# EAGLE design CARA_ctrl_v1_2 (EAGLE 7.3.0)

## Sheet 1 of 5

## Sheet 2 of 5
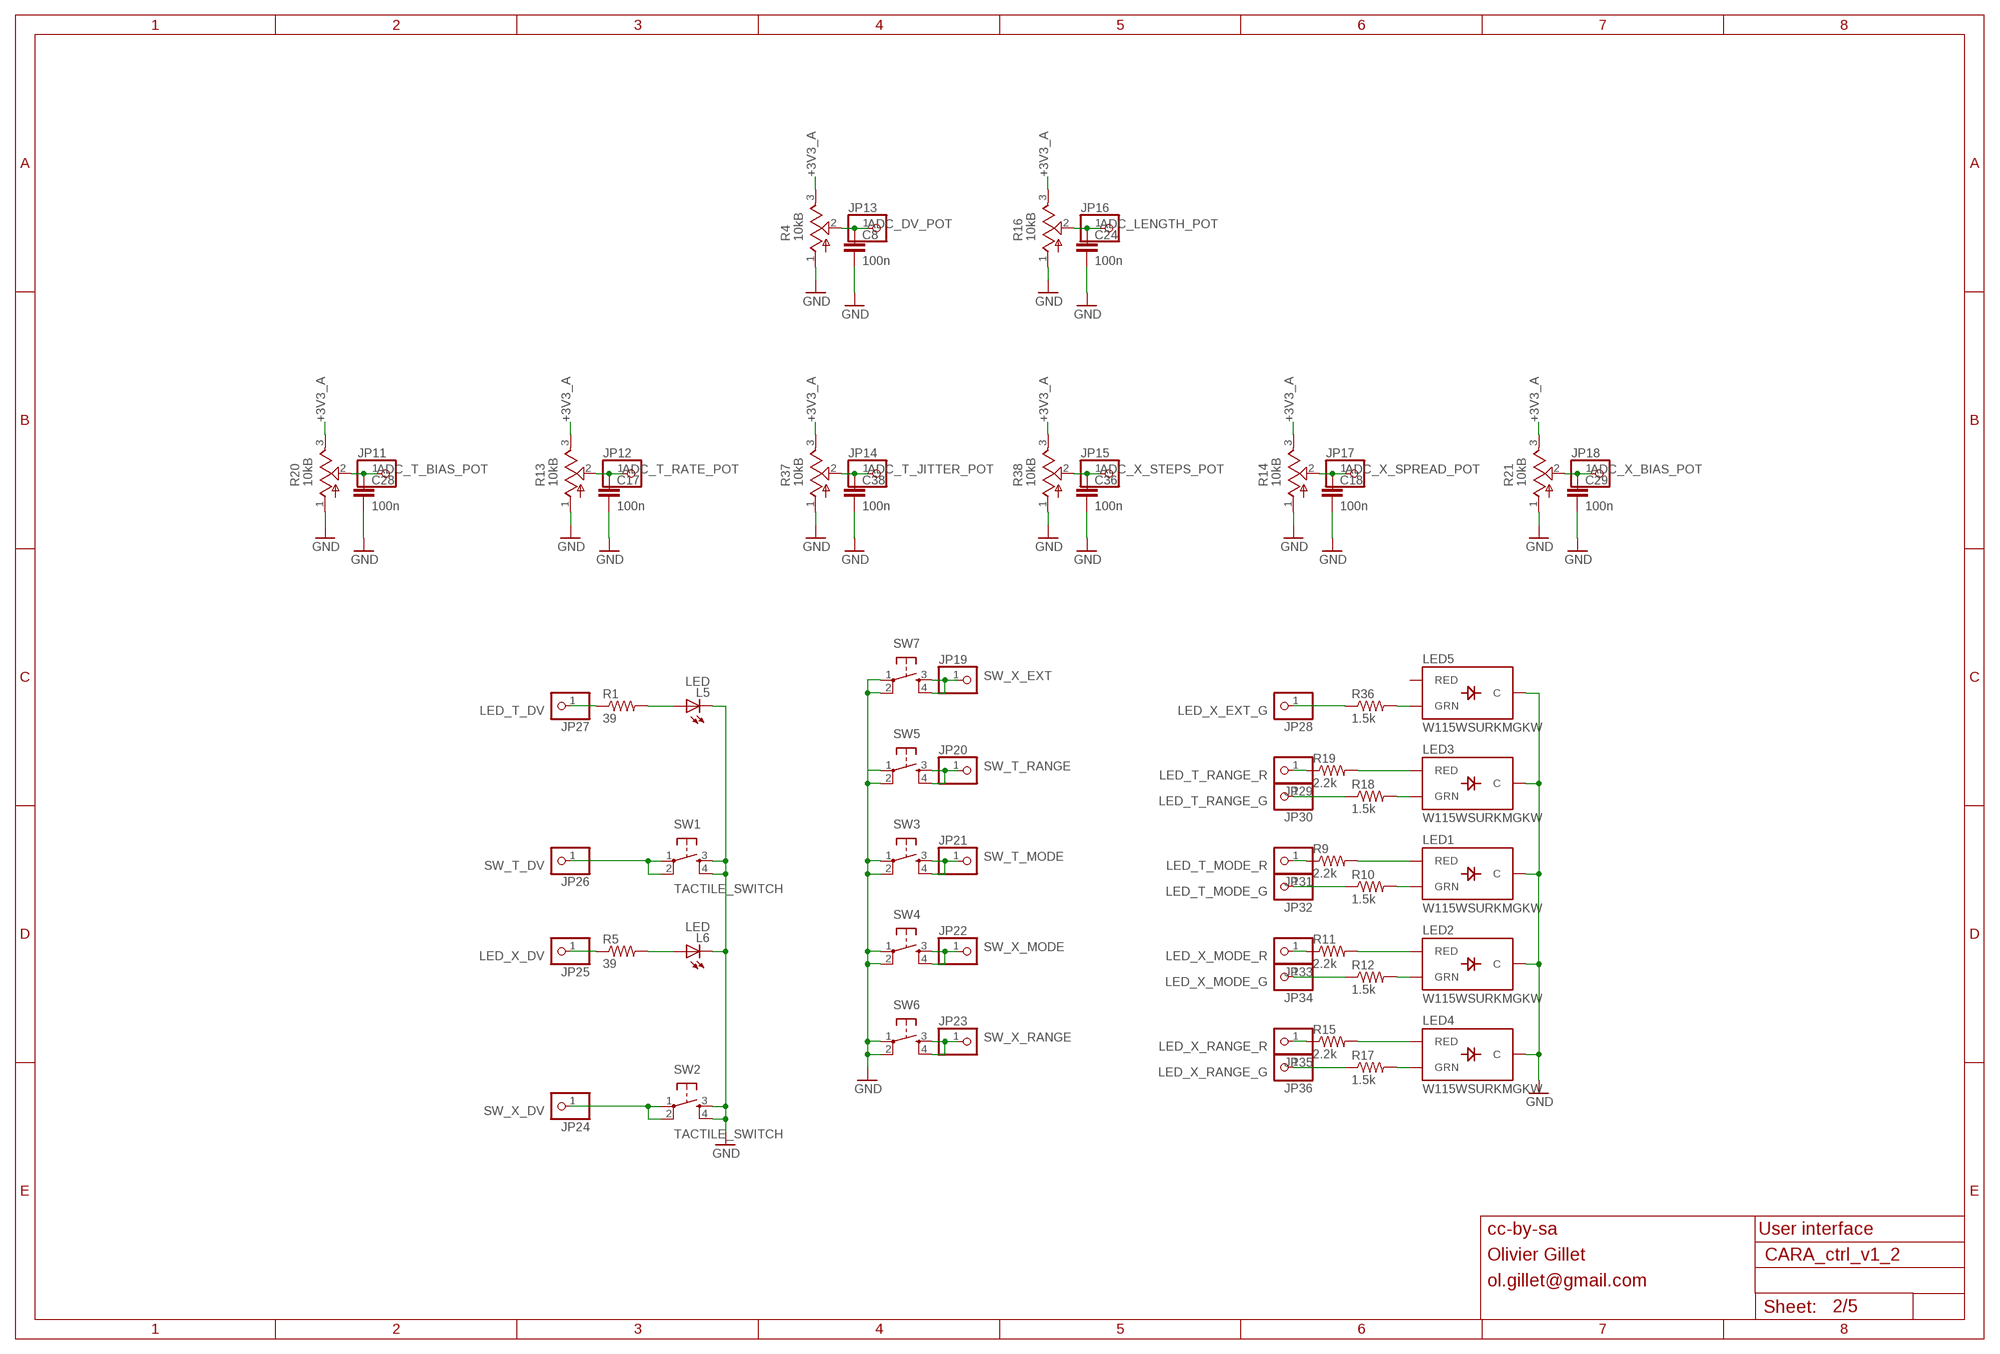
[diagram p0: schematic, sheet 2]

### Parts
C8  100n  CAPACITOR  [RESISTOR_0603]
C17  100n  CAPACITOR  [RESISTOR_0603]
C18  100n  CAPACITOR  [RESISTOR_0603]
C24  100n  CAPACITOR  [RESISTOR_0603]
C28  100n  CAPACITOR  [RESISTOR_0603]
C29  100n  CAPACITOR  [RESISTOR_0603]
C36  100n  CAPACITOR  [RESISTOR_0603]
C38  100n  CAPACITOR  [RESISTOR_0603]
JP11  PINHD-1X1  [1X01]
JP12  PINHD-1X1  [1X01]
JP13  PINHD-1X1  [1X01]
JP14  PINHD-1X1  [1X01]
JP15  PINHD-1X1  [1X01]
JP16  PINHD-1X1  [1X01]
JP17  PINHD-1X1  [1X01]
JP18  PINHD-1X1  [1X01]
JP19  PINHD-1X1  [1X01]
JP20  PINHD-1X1  [1X01]
JP21  PINHD-1X1  [1X01]
JP22  PINHD-1X1  [1X01]
JP23  PINHD-1X1  [1X01]
JP24  PINHD-1X1  [1X01]
JP25  PINHD-1X1  [1X01]
JP26  PINHD-1X1  [1X01]
JP27  PINHD-1X1  [1X01]
JP28  PINHD-1X1  [1X01]
JP29  PINHD-1X1  [1X01]
JP30  PINHD-1X1  [1X01]
JP31  PINHD-1X1  [1X01]
JP32  PINHD-1X1  [1X01]
JP33  PINHD-1X1  [1X01]
JP34  PINHD-1X1  [1X01]
JP35  PINHD-1X1  [1X01]
JP36  PINHD-1X1  [1X01]
L5  LED  [LED_3MM]
L6  LED  [LED_3MM]
LED1  W115WSURKMGKW  LED_BICOLOR_THROUGHHOLE  [LED_BICOLOR]
LED2  W115WSURKMGKW  LED_BICOLOR_THROUGHHOLE  [LED_BICOLOR]
LED3  W115WSURKMGKW  LED_BICOLOR_THROUGHHOLE  [LED_BICOLOR]
LED4  W115WSURKMGKW  LED_BICOLOR_THROUGHHOLE  [LED_BICOLOR]
LED5  W115WSURKMGKW  LED_BICOLOR_THROUGHHOLE  [LED_BICOLOR]
R1  39  RESISTOR  [RESISTOR_0603]
R4  10kB  POT_VERTICAL  [ALPS_POT_VERTICAL]
R5  39  RESISTOR  [RESISTOR_0603]
R9  2.2k  RESISTOR  [RESISTOR_0603]
R10  1.5k  RESISTOR  [RESISTOR_0603]
R11  2.2k  RESISTOR  [RESISTOR_0603]
R12  1.5k  RESISTOR  [RESISTOR_0603]
R13  10kB  POT_VERTICAL  [ALPS_POT_VERTICAL]
R14  10kB  POT_VERTICAL  [ALPS_POT_VERTICAL]
R15  2.2k  RESISTOR  [RESISTOR_0603]
R16  10kB  POT_VERTICAL  [ALPS_POT_VERTICAL]
R17  1.5k  RESISTOR  [RESISTOR_0603]
R18  1.5k  RESISTOR  [RESISTOR_0603]
R19  2.2k  RESISTOR  [RESISTOR_0603]
R20  10kB  POT_VERTICAL  [ALPS_POT_VERTICAL]
R21  10kB  POT_VERTICAL  [ALPS_POT_VERTICAL]
R36  1.5k  RESISTOR  [RESISTOR_0603]
R37  10kB  POT_VERTICAL  [ALPS_POT_VERTICAL]
R38  10kB  POT_VERTICAL  [ALPS_POT_VERTICAL]
SW1  TACTILE_SWITCH  [TACTILE-PTH]
SW2  TACTILE_SWITCH  [TACTILE-PTH]
SW3  TACTILE_SWITCH  [TACTILE-PTH]
SW4  TACTILE_SWITCH  [TACTILE-PTH]
SW5  TACTILE_SWITCH  [TACTILE-PTH]
SW6  TACTILE_SWITCH  [TACTILE-PTH]
SW7  TACTILE_SWITCH  [TACTILE-PTH]

### Nets
+3V3_A [mid]: R4.3(B) R13.3(B) R14.3(B) R16.3(B) R20.3(B) R21.3(B) R37.3(B) R38.3(B) ; also sheet 5
ADC_DV_POT: C8.1 JP13.1 R4.2(W)
ADC_LENGTH_POT: C24.1 JP16.1 R16.2(W)
ADC_T_BIAS_POT: C28.1 JP11.1 R20.2(W)
ADC_T_JITTER_POT: C38.1 JP14.1 R37.2(W)
ADC_T_RATE_POT: C17.1 JP12.1 R13.2(W)
ADC_X_BIAS_POT: C29.1 JP18.1 R21.2(W)
ADC_X_SPREAD_POT: C18.1 JP17.1 R14.2(W)
ADC_X_STEPS_POT: C36.1 JP15.1 R38.2(W)
GND: C8.2 C17.2 C18.2 C24.2 C28.2 C29.2 C36.2 C38.2 L5.K(C) L6.K(C) LED1.2(C) LED2.2(C) LED3.2(C) LED4.2(C) LED5.2(C) R4.1(A) R13.1(A) R14.1(A) R16.1(A) R20.1(A) R21.1(A) R37.1(A) R38.1(A) SW1.3 SW1.4 SW2.3 SW2.4 SW3.1 SW3.2 SW4.1 SW4.2 SW5.1 SW5.2 SW6.1 SW6.2 SW7.1 SW7.2 ; also sheet 3,4,5
LED_T_DV: JP27.1 R1.1
LED_T_MODE_G: JP32.1 R10.1
LED_T_MODE_R: JP31.1 R9.1
LED_T_RANGE_G: JP30.1 R18.1
LED_T_RANGE_R: JP29.1 R19.1
LED_X_DV: JP25.1 R5.1
LED_X_EXT_G: JP28.1 R36.1
LED_X_MODE_G: JP34.1 R12.1
LED_X_MODE_R: JP33.1 R11.1
LED_X_RANGE_G: JP36.1 R17.1
LED_X_RANGE_R: JP35.1 R15.1
N$1: L5.A R1.2
N$2: L6.A R5.2
N$9: LED3.3(RED) R19.2
N$12: LED3.1(GRN) R18.2
N$16: LED1.3(RED) R9.2
N$18: LED2.3(RED) R11.2
N$20: LED2.1(GRN) R12.2
N$21: LED4.3(RED) R15.2
N$22: LED1.1(GRN) R10.2
N$23: LED4.1(GRN) R17.2
N$42: LED5.1(GRN) R36.2
SW_T_DV: JP26.1 SW1.1 SW1.2
SW_T_MODE: JP21.1 SW3.3 SW3.4
SW_T_RANGE: JP20.1 SW5.3 SW5.4
SW_X_DV: JP24.1 SW2.1 SW2.2
SW_X_EXT: JP19.1 SW7.3 SW7.4
SW_X_MODE: JP22.1 SW4.3 SW4.4
SW_X_RANGE: JP23.1 SW6.3 SW6.4
Unconnected: LED5.3(RED)

### Notes on the sheet
- cc-by-sa | User interface
- Olivier Gillet
- ol.gillet@gmail.com

## Sheet 3 of 5
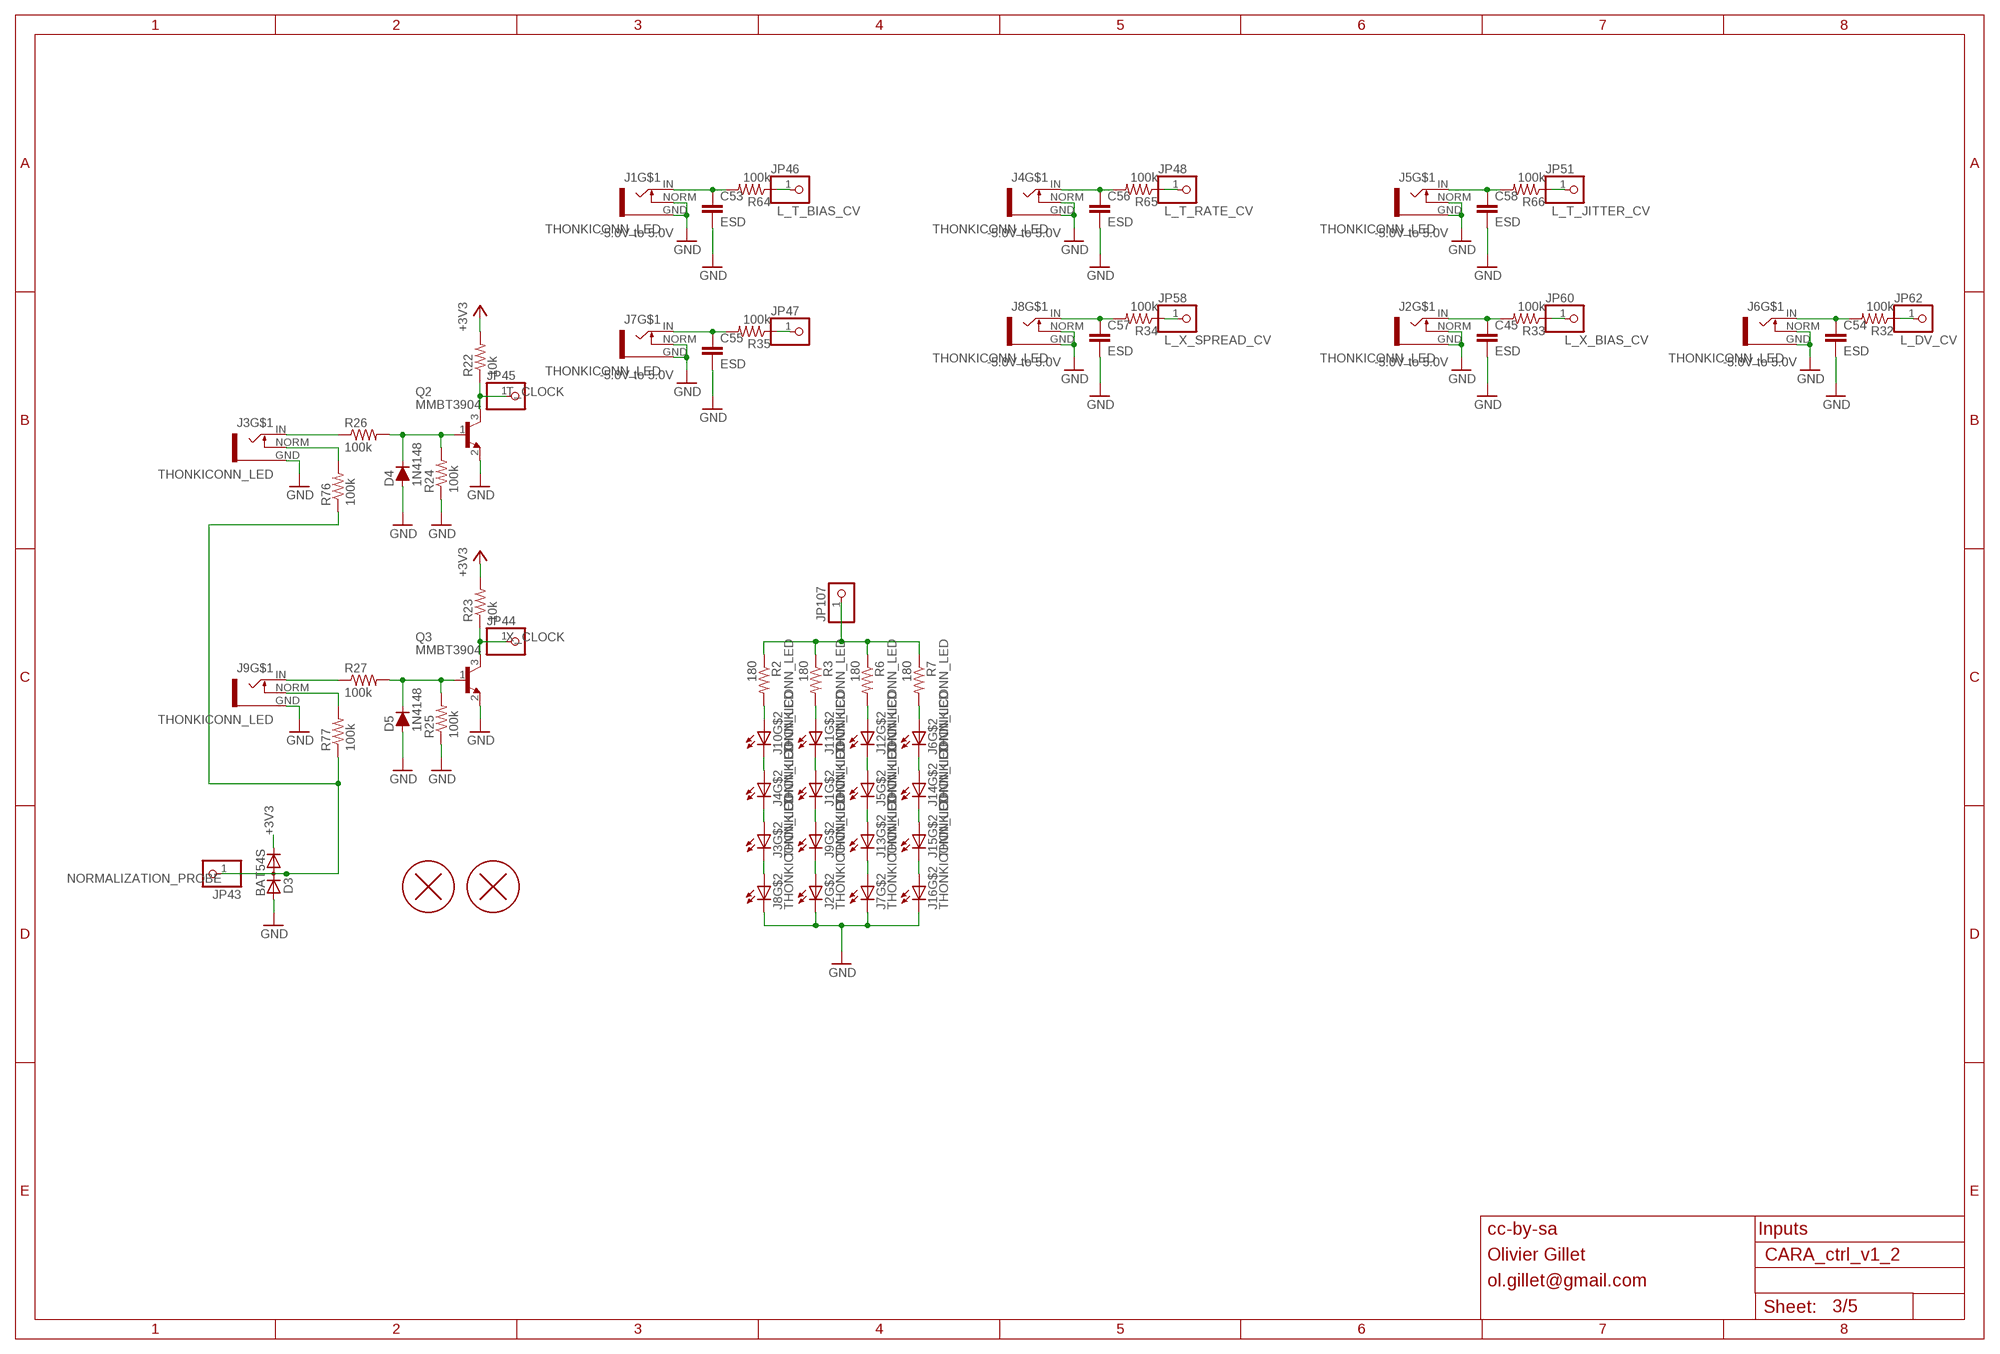
[diagram p1: schematic, sheet 3]

### Parts
C45  ESD  CAPACITOR  [RESISTOR_0603]
C53  ESD  CAPACITOR  [RESISTOR_0603]
C54  ESD  CAPACITOR  [RESISTOR_0603]
C55  ESD  CAPACITOR  [RESISTOR_0603]
C56  ESD  CAPACITOR  [RESISTOR_0603]
C57  ESD  CAPACITOR  [RESISTOR_0603]
C58  ESD  CAPACITOR  [RESISTOR_0603]
D3  BAT54S  DIODE_2CACA-SOT23  [SOT23]
D4  1N4148  DIODE  [SOD123]
D5  1N4148  DIODE  [SOD123]
H1  PCB_SCREW  [PCB_SCREW]
H2  PCB_SCREW  [PCB_SCREW]
J1  THONKICONN_LED  [LED_JACK]
J2  THONKICONN_LED  [LED_JACK]
J3  THONKICONN_LED  [LED_JACK]
J4  THONKICONN_LED  [LED_JACK]
J5  THONKICONN_LED  [LED_JACK]
J6  THONKICONN_LED  [LED_JACK]
J7  THONKICONN_LED  [LED_JACK]
J8  THONKICONN_LED  [LED_JACK]
J9  THONKICONN_LED  [LED_JACK]
J10  THONKICONN_LED  [LED_JACK]
J11  THONKICONN_LED  [LED_JACK]
J12  THONKICONN_LED  [LED_JACK]
J13  THONKICONN_LED  [LED_JACK]
J14  THONKICONN_LED  [LED_JACK]
J15  THONKICONN_LED  [LED_JACK]
J16  THONKICONN_LED  [LED_JACK]
JP43  PINHD-1X1  [1X01]
JP44  PINHD-1X1  [1X01]
JP45  PINHD-1X1  [1X01]
JP46  PINHD-1X1  [1X01]
JP47  PINHD-1X1  [1X01]
JP48  PINHD-1X1  [1X01]
JP51  PINHD-1X1  [1X01]
JP58  PINHD-1X1  [1X01]
JP60  PINHD-1X1  [1X01]
JP62  PINHD-1X1  [1X01]
JP107  PINHD-1X1  [1X01]
Q2  MMBT3904  MMBT3904SOT23  [SOT23]
Q3  MMBT3904  MMBT3904SOT23  [SOT23]
R2  180  RESISTOR  [RESISTOR_0603]
R3  180  RESISTOR  [RESISTOR_0603]
R6  180  RESISTOR  [RESISTOR_0603]
R7  180  RESISTOR  [RESISTOR_0603]
R22  10k  RESISTOR  [RESISTOR_0603]
R23  10k  RESISTOR  [RESISTOR_0603]
R24  100k  RESISTOR  [RESISTOR_0603]
R25  100k  RESISTOR  [RESISTOR_0603]
R26  100k  RESISTOR  [RESISTOR_0603]
R27  100k  RESISTOR  [RESISTOR_0603]
R32  100k  RESISTOR  [RESISTOR_0603]
R33  100k  RESISTOR  [RESISTOR_0603]
R34  100k  RESISTOR  [RESISTOR_0603]
R35  100k  RESISTOR  [RESISTOR_0603]
R64  100k  RESISTOR  [RESISTOR_0603]
R65  100k  RESISTOR  [RESISTOR_0603]
R66  100k  RESISTOR  [RESISTOR_0603]
R76  100k  RESISTOR  [RESISTOR_0603]
R77  100k  RESISTOR  [RESISTOR_0603]

### Nets
+3V3 [mid]: D3.2(C) R22.2 R23.2 ; also sheet 5
GND: C45.2 C53.2 C54.2 C55.2 C56.2 C57.2 C58.2 D3.1(A) D4.+ D5.+ J1.GND J1.NORM J2.C J2.GND J2.NORM J3.GND J4.GND J4.NORM J5.GND J5.NORM J6.GND J6.NORM J7.C J7.GND J7.NORM J8.C J8.GND J8.NORM J9.GND J16.C Q2.2(E) Q3.2(E) R24.1 R25.1 ; also sheet 2,4,5
L_DV_CV: JP62.1 R32.1
L_T_BIAS_CV: JP46.1 R64.1
L_T_JITTER_CV: JP51.1 R66.1
L_T_RATE_CV: JP48.1 R65.1
L_X_BIAS_CV: JP60.1 R33.1
L_X_SPREAD_CV: JP58.1 R34.1
L_X_STEPS_CV: JP47.1 R35.1
MORPH_IN: C53.1 J1.IN R64.2
MORPH_IN1: C55.1 J7.IN R35.2
MORPH_IN3: C56.1 J4.IN R65.2
MORPH_IN4: C57.1 J8.IN R34.2
MORPH_IN5: C54.1 J6.IN R32.2
MORPH_IN6: C58.1 J5.IN R66.2
MORPH_IN7: C45.1 J2.IN R33.2
N$4: J4.A J10.C
N$5: J3.A J4.C
N$6: J1.A J11.C
N$7: J1.C J9.A
N$8: J3.C J8.A
N$10: J5.A J12.C
N$11: J6.C J14.A
N$13: J2.A J9.C
N$15: J5.C J13.A
N$17: J7.A J13.C
N$19: J14.C J15.A
N$25: J15.C J16.A
N$27: J10.A R2.2
N$31: J12.A R6.2
N$32: J6.A R7.2
N$33: J11.A R3.2
N$36: J9.IN R27.1
N$43 [wide]: JP107.1 R2.1 R3.1 R6.1 R7.1
N$46: J9.NORM R77.2
N$47: J3.NORM R76.2
N$50: D4.- Q2.1(B) R24.2 R26.2
N$52: D5.- Q3.1(B) R25.2 R27.2
N$57: J3.IN R26.1
NORMALIZATION_PROBE: D3.3(AC) JP43.1 R76.1 R77.1
T_CLOCK: JP45.1 Q2.3(C) R22.1
X_CLOCK: JP44.1 Q3.3(C) R23.1

### Notes on the sheet
- -5.0V to 5.0V | -5.0V to 5.0V | -5.0V to 5.0V
- -5.0V to 5.0V | -5.0V to 5.0V | -5.0V to 5.0V
- -5.0V to 5.0V
- cc-by-sa | Inputs
- Olivier Gillet
- ol.gillet@gmail.com

## Sheet 4 of 5
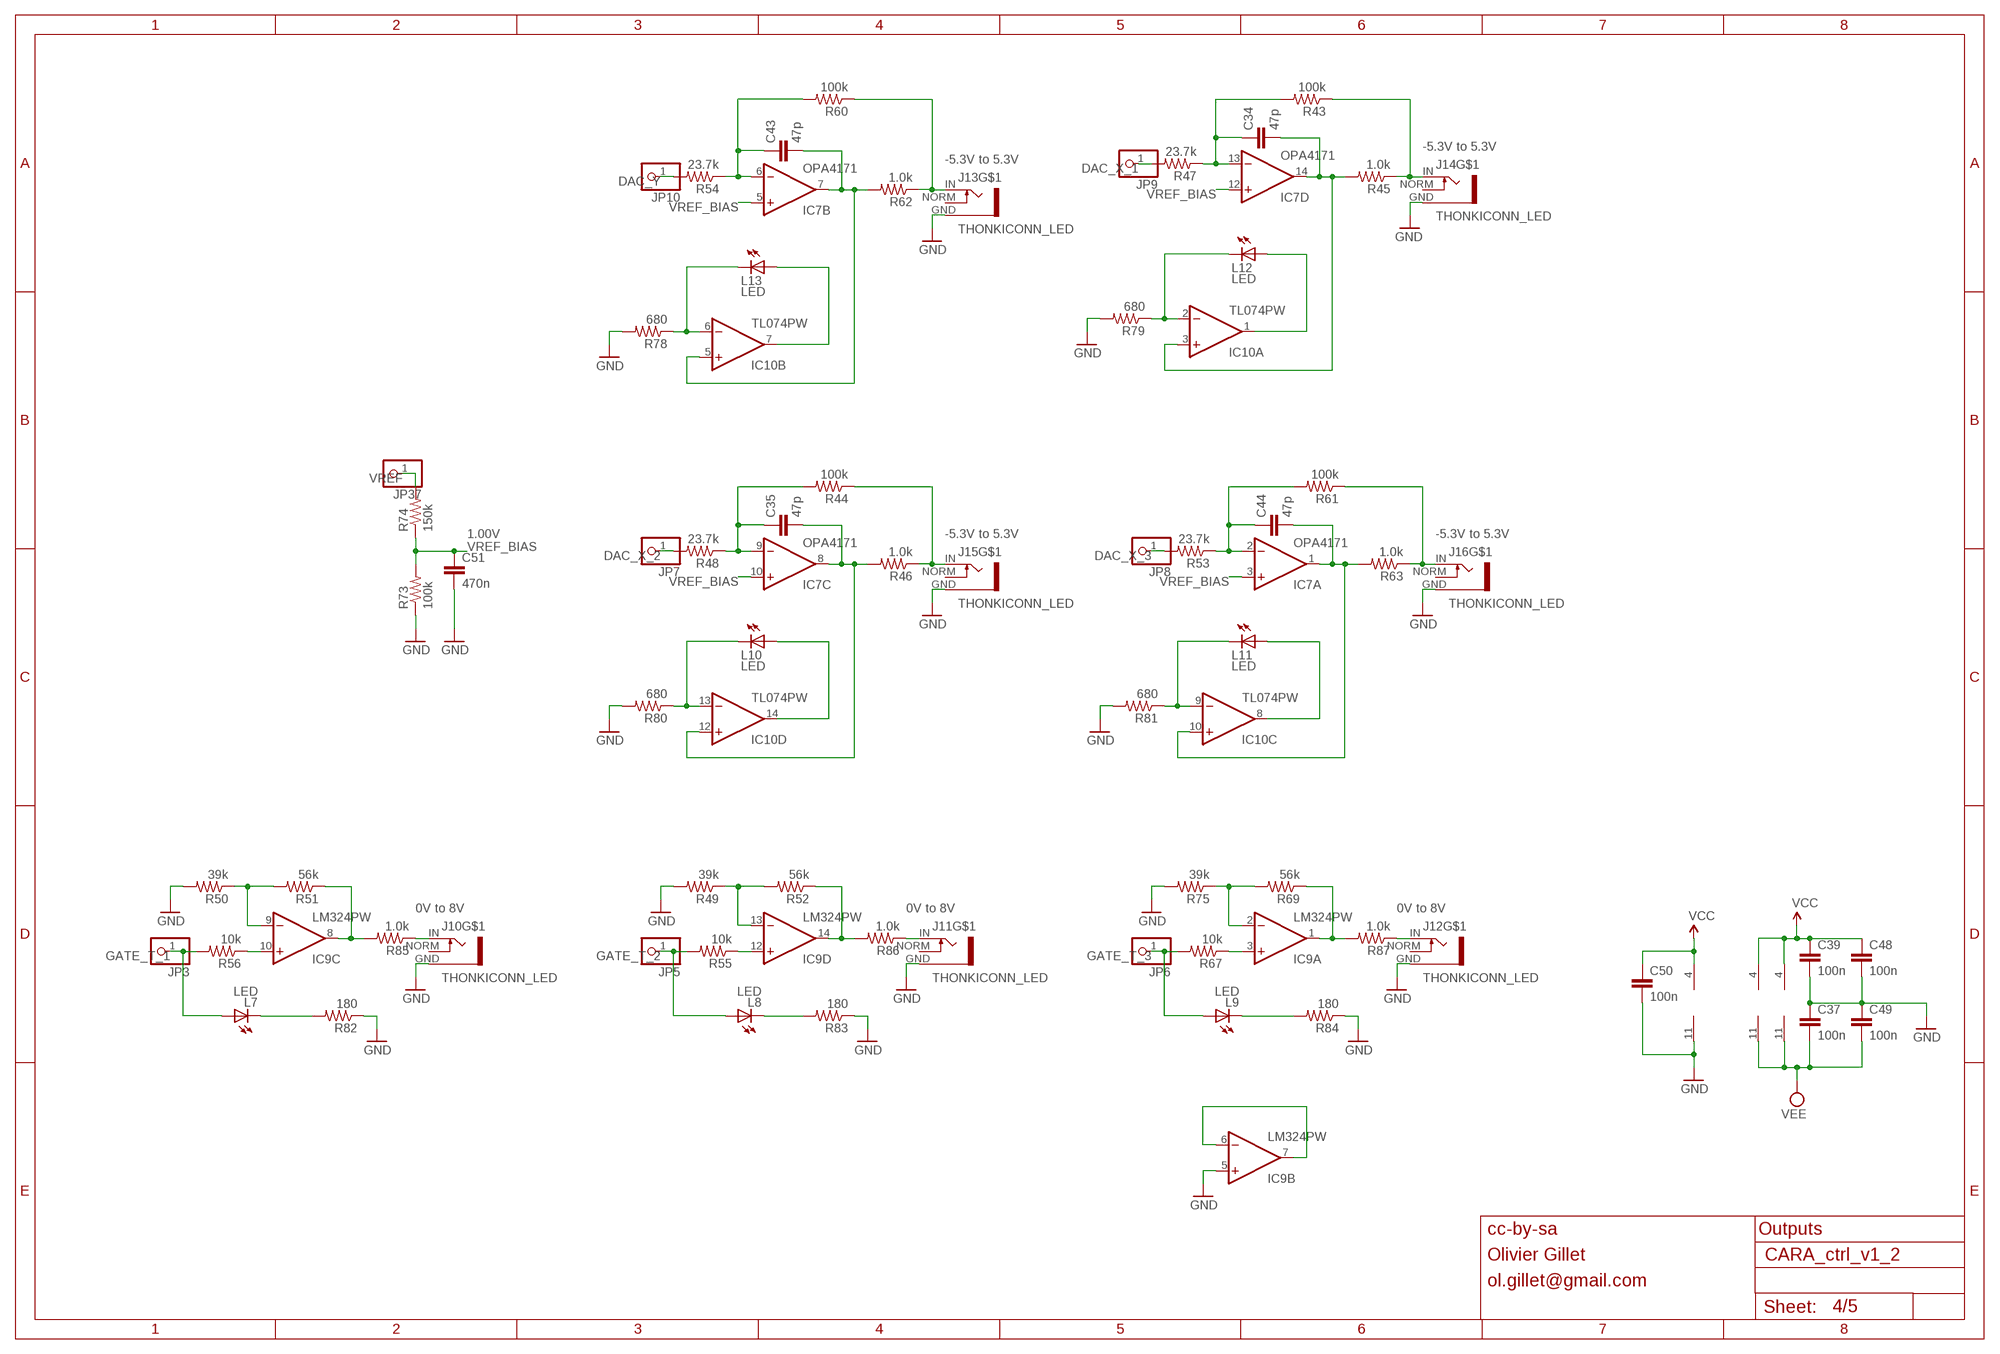
[diagram p2: schematic, sheet 4]

### Parts
C34  47p  CAPACITOR  [RESISTOR_0603]
C35  47p  CAPACITOR  [RESISTOR_0603]
C37  100n  CAPACITOR  [RESISTOR_0603]
C39  100n  CAPACITOR  [RESISTOR_0603]
C43  47p  CAPACITOR  [RESISTOR_0603]
C44  47p  CAPACITOR  [RESISTOR_0603]
C48  100n  CAPACITOR  [RESISTOR_0603]
C49  100n  CAPACITOR  [RESISTOR_0603]
C50  100n  CAPACITOR  [RESISTOR_0603]
C51  470n  CAPACITOR  [RESISTOR_0603]
IC7  OPA4171  TL074PW  [TSSOP14_065]
IC9  LM324PW  TL074PW  [TSSOP14_065]
IC10  TL074PW  [TSSOP14_065]
JP3  PINHD-1X1  [1X01]
JP5  PINHD-1X1  [1X01]
JP6  PINHD-1X1  [1X01]
JP7  PINHD-1X1  [1X01]
JP8  PINHD-1X1  [1X01]
JP9  PINHD-1X1  [1X01]
JP10  PINHD-1X1  [1X01]
JP37  PINHD-1X1  [1X01]
L7  LED  [LED_3MM]
L8  LED  [LED_3MM]
L9  LED  [LED_3MM]
L10  LED  [LED_3MM]
L11  LED  [LED_3MM]
L12  LED  [LED_3MM]
L13  LED  [LED_3MM]
R43  100k  RESISTOR  [RESISTOR_0603]
R44  100k  RESISTOR  [RESISTOR_0603]
R45  1.0k  RESISTOR  [RESISTOR_0603]
R46  1.0k  RESISTOR  [RESISTOR_0603]
R47  23.7k  RESISTOR  [RESISTOR_0603]
R48  23.7k  RESISTOR  [RESISTOR_0603]
R49  39k  RESISTOR  [RESISTOR_0603]
R50  39k  RESISTOR  [RESISTOR_0603]
R51  56k  RESISTOR  [RESISTOR_0603]
R52  56k  RESISTOR  [RESISTOR_0603]
R53  23.7k  RESISTOR  [RESISTOR_0603]
R54  23.7k  RESISTOR  [RESISTOR_0603]
R55  10k  RESISTOR  [RESISTOR_0603]
R56  10k  RESISTOR  [RESISTOR_0603]
R60  100k  RESISTOR  [RESISTOR_0603]
R61  100k  RESISTOR  [RESISTOR_0603]
R62  1.0k  RESISTOR  [RESISTOR_0603]
R63  1.0k  RESISTOR  [RESISTOR_0603]
R67  10k  RESISTOR  [RESISTOR_0603]
R69  56k  RESISTOR  [RESISTOR_0603]
R73  100k  RESISTOR  [RESISTOR_0603]
R74  150k  RESISTOR  [RESISTOR_0603]
R75  39k  RESISTOR  [RESISTOR_0603]
R78  680  RESISTOR  [RESISTOR_0603]
R79  680  RESISTOR  [RESISTOR_0603]
R80  680  RESISTOR  [RESISTOR_0603]
R81  680  RESISTOR  [RESISTOR_0603]
R82  180  RESISTOR  [RESISTOR_0603]
R83  180  RESISTOR  [RESISTOR_0603]
R84  180  RESISTOR  [RESISTOR_0603]
R85  1.0k  RESISTOR  [RESISTOR_0603]
R86  1.0k  RESISTOR  [RESISTOR_0603]
R87  1.0k  RESISTOR  [RESISTOR_0603]

### Nets
DAC_X_1: JP9.1 R47.2
DAC_X_2: JP7.1 R48.2
DAC_X_3: JP8.1 R53.2
DAC_Y: JP10.1 R54.2
GATE_T_1: JP3.1 L7.A R56.2
GATE_T_2: JP5.1 L8.A R55.2
GATE_T_3: JP6.1 L9.A R67.2
GND: C37.1 C39.2 C48.2 C49.1 C50.2 C51.2 IC9.5(B:+IN) IC9.11(P:V-) J10.GND J11.GND J12.GND J13.GND J14.GND J15.GND J16.GND R49.2 R50.2 R73.1 R75.2 R78.2 R79.2 R80.2 R81.2 R82.1 R83.1 R84.1 ; also sheet 2,3,5
N$3: IC9.12(D:+IN) R55.1
N$14: IC9.8(C:OUT) R51.1 R85.2
N$24: J10.IN R85.1
N$26: IC9.9(C:-IN) R50.1 R51.2
N$28: L7.K(C) R82.2
N$29: IC9.10(C:+IN) R56.1
N$30: IC9.6(B:-IN) IC9.7(B:OUT)
N$34: IC9.14(D:OUT) R52.1 R86.2
N$35: IC9.13(D:-IN) R49.1 R52.2
N$37: IC9.3(A:+IN) R67.1
N$38: IC9.1(A:OUT) R69.1 R87.2
N$39: J11.IN R86.1
N$40: J12.IN R87.1
N$41: IC9.2(A:-IN) R69.2 R75.1
N$44: L8.K(C) R83.2
N$45: C43.2 IC7.7(B:OUT) IC10.5(B:+IN) R62.2
N$48: L9.K(C) R84.2
N$49: J15.IN R44.1 R46.1
N$53: J13.IN R60.1 R62.1
N$54: C35.1 IC7.9(C:-IN) R44.2 R48.1
N$58: J16.IN R61.1 R63.1
N$59: C44.1 IC7.2(A:-IN) R53.1 R61.2
N$60: C34.1 IC7.13(D:-IN) R43.2 R47.1
N$61: C43.1 IC7.6(B:-IN) R54.1 R60.2
N$63: J14.IN R43.1 R45.1
N$67: IC10.6(B:-IN) L13.K(C) R78.1
N$68: IC10.7(B:OUT) L13.A
N$70: C34.2 IC7.14(D:OUT) IC10.3(A:+IN) R45.2
N$71: IC10.2(A:-IN) L12.K(C) R79.1
N$72: IC10.1(A:OUT) L12.A
N$73: C35.2 IC7.8(C:OUT) IC10.12(D:+IN) R46.2
N$74: IC10.13(D:-IN) L10.K(C) R80.1
N$75: IC10.14(D:OUT) L10.A
N$76: C44.2 IC7.1(A:OUT) IC10.10(C:+IN) R63.2
N$77: IC10.9(C:-IN) L11.K(C) R81.1
N$78: IC10.8(C:OUT) L11.A
VCC [wide]: C39.1 C48.1 C50.1 IC7.4(P:V+) IC9.4(P:V+) IC10.4(P:V+) ; also sheet 5
VEE [wide]: C37.2 C49.2 IC7.11(P:V-) IC10.11(P:V-) ; also sheet 5
VREF: JP37.1 R74.2
VREF_BIAS: C51.1 IC7.3(A:+IN) IC7.5(B:+IN) IC7.10(C:+IN) IC7.12(D:+IN) R73.2 R74.1
Unconnected: J10.NORM J11.NORM J12.NORM J13.NORM J14.NORM J15.NORM J16.NORM

### Notes on the sheet
- -5.3V to 5.3V
- -5.3V to 5.3V
- 1.00V | -5.3V to 5.3V | -5.3V to 5.3V
- 0V to 8V | 0V to 8V | 0V to 8V
- cc-by-sa | Outputs
- Olivier Gillet
- ol.gillet@gmail.com

## Sheet 5 of 5
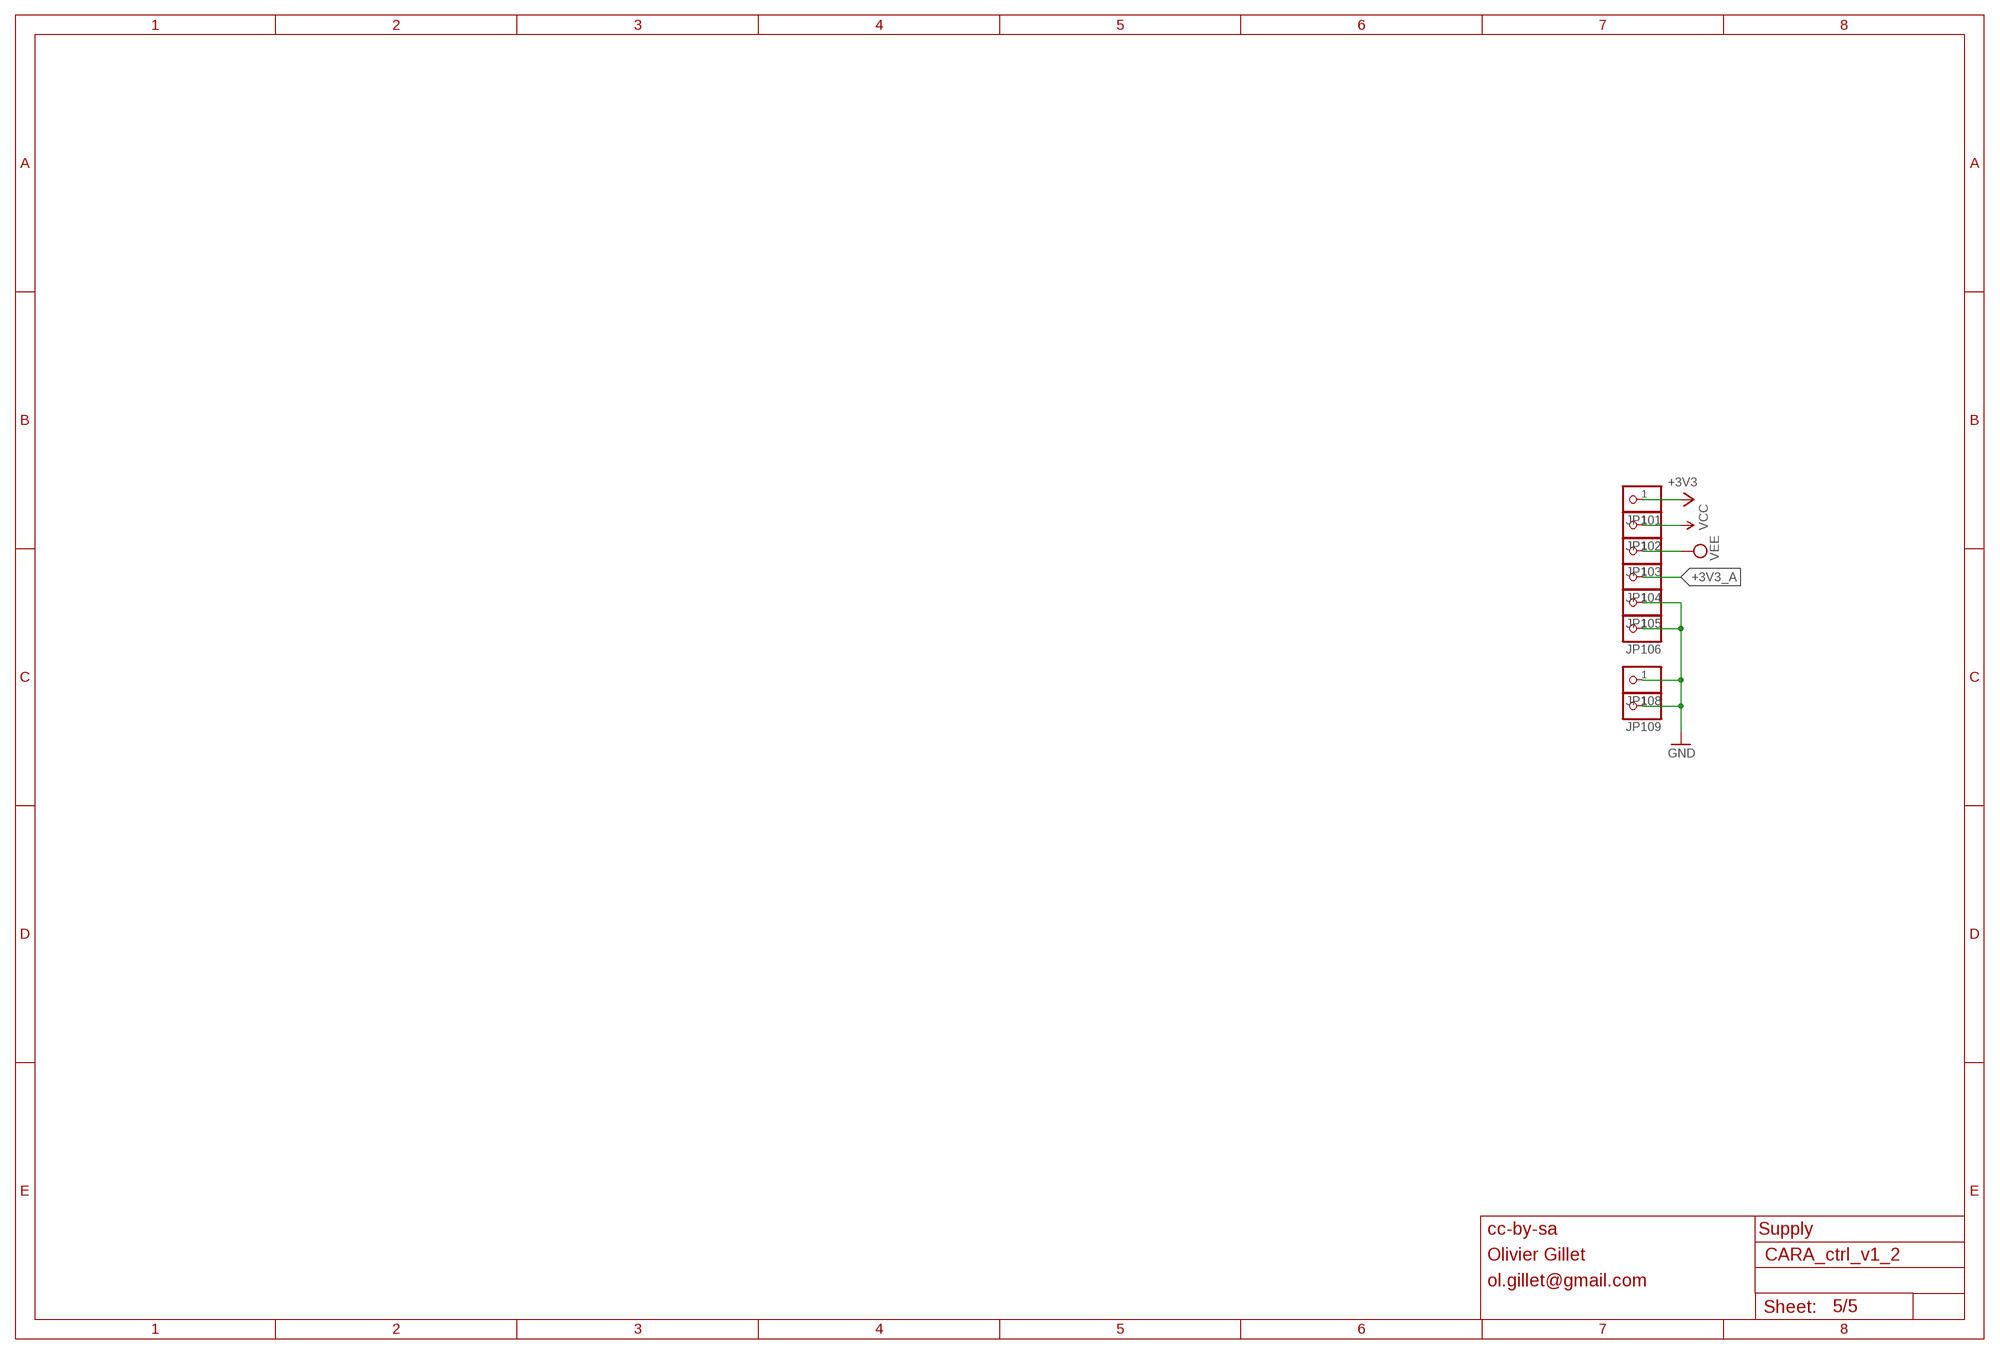
[diagram p3: schematic, sheet 5]

### Parts
JP101  PINHD-1X1  [1X01]
JP102  PINHD-1X1  [1X01]
JP103  PINHD-1X1  [1X01]
JP104  PINHD-1X1  [1X01]
JP105  PINHD-1X1  [1X01]
JP106  PINHD-1X1  [1X01]
JP108  PINHD-1X1  [1X01]
JP109  PINHD-1X1  [1X01]

### Nets
+3V3 [mid]: JP101.1 ; also sheet 3
+3V3_A [mid]: JP104.1 ; also sheet 2
GND: JP105.1 JP106.1 JP108.1 JP109.1 ; also sheet 2,3,4
VCC [wide]: JP102.1 ; also sheet 4
VEE [wide]: JP103.1 ; also sheet 4

### Notes on the sheet
- cc-by-sa | Supply
- Olivier Gillet
- ol.gillet@gmail.com

## Library data of the parts
C8 C17 C18 C24 C28 C29 C34-C39 C43-C45 C48-C51 C53-C58 = parts_aman:CAPACITOR
D3 = diode:DIODE_2CACA-: 2 Diodes - Cathode-Anode|Cathode-Anode
D4 D5 = parts_aman:DIODE
H1 H2 = parts_aman:PCB_SCREW
IC7 IC9 IC10 = og-linear:TL074: OP AMP
J1-J16 = parts_aman:THONKICONN_LED
JP3 JP5-JP37 JP43-JP48 JP51 JP58 JP60 JP62 JP101-JP109 = parts_aman:PINHD-1X1: PIN HEADER
L5-L13 = parts_aman:LED
LED1-LED5 = parts_aman:LED_BICOLOR_THROUGHHOLE
Q2 Q3 = parts_aman:MMBT3904
R1-R3 R5-R7 R9-R12 R15 R17-R19 R22-R27 R32-R36 R43-R56 R60-R67 R69 R73-R87 = parts_aman:RESISTOR
R4 R13 R14 R16 R20 R21 R37 R38 = parts_aman:POT_VERTICAL
SW1-SW7 = parts_aman:TACTILE_SWITCH

## Net classes
0 default: width 0.152 mm, drill 0.305 mm, clearance 0.152 mm
1 mid: width 0.254 mm, drill 0.305 mm, clearance 0.152 mm
2 wide: width 0.305 mm, drill 0.305 mm, clearance 0.152 mm

## Board
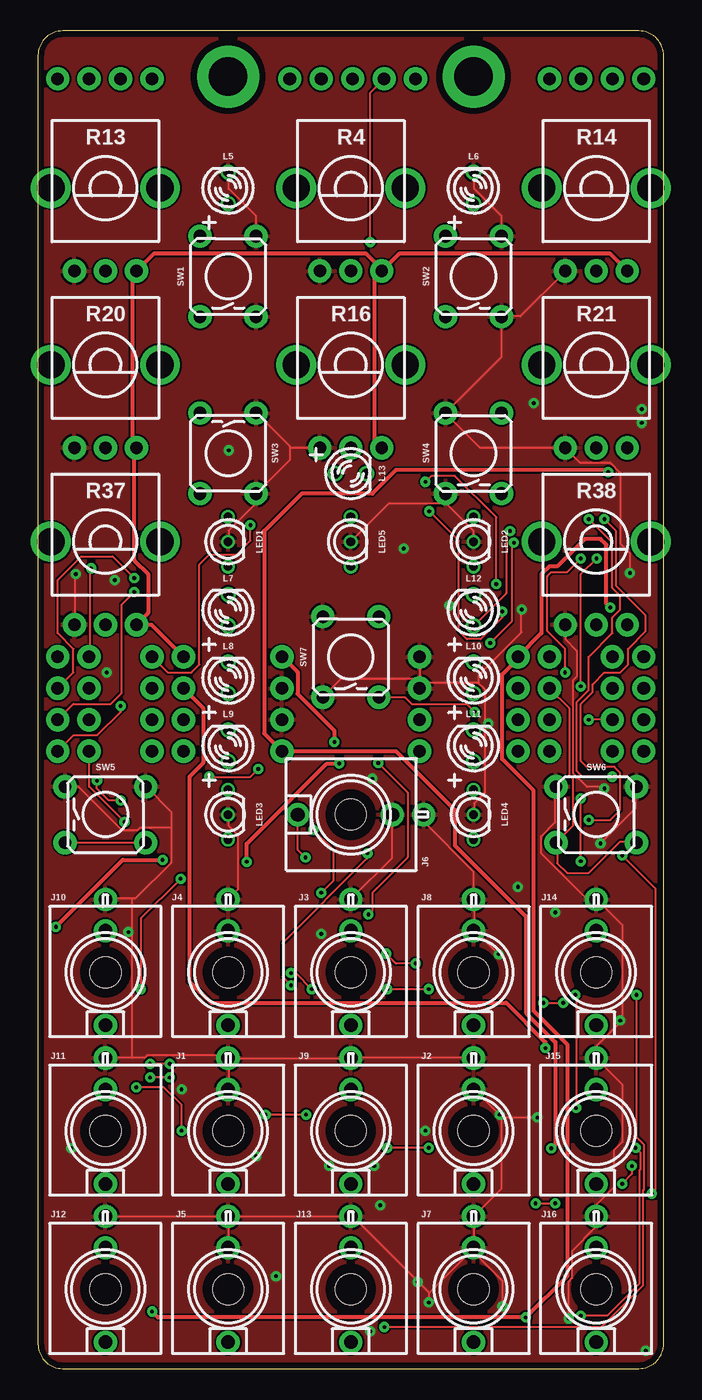
[diagram p4: board, top side]
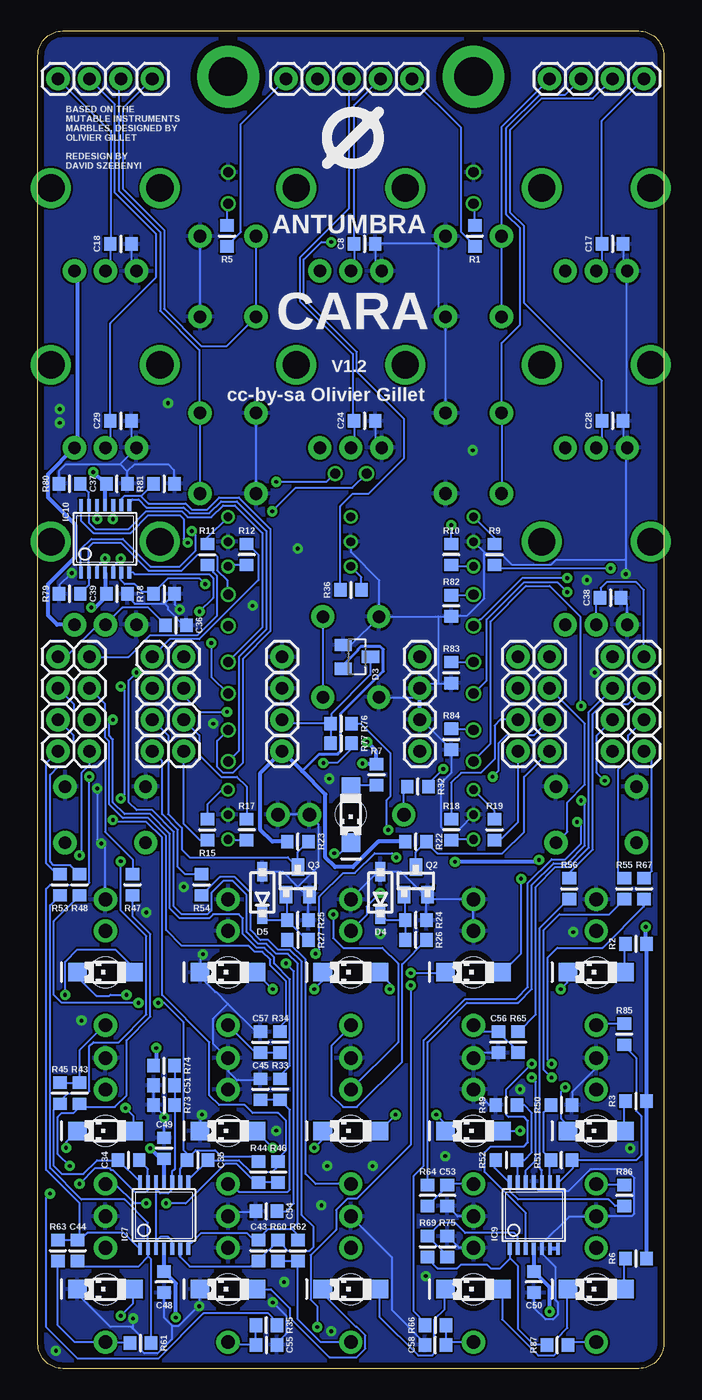
[diagram p5: board, bottom side, seen from below]

Size 50.5 x 108 mm. Coordinates in mm from the lower left corner, seen from the top.
Outline: 2,0 48.5,0 arc90 50.5,2 50.5,106 arc90 48.5,108 2,108 arc90 0,106 0,2 arc90 2,0
Copper layers (1*16): Top 0.035mm / dielectric 1.5mm / Bottom 0.035mm
Design rules "PCBCart-Standard": minimum track width 6mil, minimum drill 12mil, track to track 6mil, track to pad 6mil, pad to pad 6mil, via to via 6mil, smd to smd 6mil, copper to edge 20mil, drill to drill 8mil, minimum pad ring 8mil, minimum via ring 10mil, stop-mask expansion 3mil, vias tented up to drill 25mil, thermal gap 8mil

### Footprints (pad centres in the part's own frame; a part is rotated, then mirrored left to right if it is on the bottom)
RESISTOR_0603 = smd 1 x 1.1: 1 -0.85,0; 2 0.85,0
SOT23 = smd 1 x 1.4: 1 -0.95,-1.1; 2 0.95,-1.1; 3 0,1.1
SOD123 = smd 1.6 x 0.8: + 1.7,0; - -1.7,0
PCB_SCREW = drill 3.1 pad 5: P$1 0,0
TSSOP14_065 = smd 0.305 x 0.991: 1 -1.95,-2.718; 2 -1.3,-2.718; 3 -0.65,-2.718; 4 0,-2.718; 5 0.65,-2.718; 6 1.3,-2.718; 7 1.95,-2.718; 8 1.95,2.718; 9 1.3,2.718; 10 0.65,2.718; 11 0,2.718; 12 -0.65,2.718; 13 -1.3,2.718; 14 -1.95,2.718
LED_JACK = smd 1.5 x 1.5 bottom: A 2.266,0; C -2.266,0 | drill 1.1 pad 1.88: GND 0,-5.88; IN 0,4.28; NORM 0,-3.34 | hole 2.5: 0,0
1X01 = drill 1.016 pad 1.88: 1 0,0
LED_3MM = drill 0.813: A -1.27,0; K 1.27,0
LED_BICOLOR = drill 0.7: 1 -2,0; 2 0,0; 3 2,0
ALPS_POT_VERTICAL = drill 1 pad 1.88: 1 -2.5,-6.7; 2 0,-6.7; 3 2.5,-6.7 | drill 2.2 pad 3.175: P$4 4.4,0; P$5 -4.4,0
TACTILE-PTH = drill 1.016 pad 1.88: 1 -3.251,2.261; 2 3.251,2.261; 3 -3.251,-2.261; 4 3.251,-2.261

### Placement (x,y rotation side)
C8  24.13,90.81 0 bottom
C17  4.13,90.81 0 bottom
C18  43.81,90.81 0 bottom
C24  24.13,76.52 0 bottom
C28  4.13,76.52 0 bottom
C29  43.81,76.52 0 bottom
C34  43.18,16.83 180 bottom
C35  37.62,16.83 0 bottom
C36  39.37,60.01 0 bottom
C37  44.13,71.44 180 bottom
C38  4.29,62.23 0 bottom
C39  44.13,62.55 0 bottom
C43  32.7,9.53 90 bottom
C44  47.31,9.53 90 bottom
C45  32.54,22.54 90 bottom
C48  40.32,6.99 270 bottom
C49  40.32,17.78 270 bottom
C50  10.48,6.99 270 bottom
C51  40.32,22.86 180 bottom
C53  17.46,13.97 270 bottom
C54  32.07,12.7 180 bottom
C55  32.07,1.91 0 bottom
C56  13.34,26.35 270 bottom
C57  32.54,26.35 90 bottom
C58  18.41,1.91 180 bottom
D3  24.77,57.47 270 bottom
D4  22.86,38.42 90 bottom
D5  32.38,38.42 90 bottom
H1  15.35,104.31 0 top
H2  35.16,104.31 0 top
IC7  40.32,12.38 0 bottom
IC9  10.48,12.38 0 bottom
IC10  45.09,66.99 0 bottom
J1  15.35,19.19 180 top
J2  35.16,19.19 180 top
J3  25.25,31.99 180 top
J4  15.35,31.99 180 top
J5  15.35,6.41 180 top
J6  25.25,44.73 90 top
J7  35.16,6.41 180 top
J8  35.16,31.99 180 top
J9  25.25,19.19 180 top
J10  5.44,31.99 180 top
J11  5.44,19.19 180 top
J12  5.44,6.41 180 top
J13  25.25,6.41 180 top
J14  45.06,31.99 180 top
J15  45.06,19.19 180 top
J16  45.06,6.41 180 top
JP3  1.59,54.93 0 bottom
JP5  1.59,52.39 0 bottom
JP6  1.59,49.85 0 bottom
JP7  48.9,52.39 0 bottom
JP8  48.9,49.85 0 bottom
JP9  48.9,54.93 0 bottom
JP10  41.27,49.85 0 bottom
JP11  4.13,104.14 0 bottom
JP12  1.59,104.14 0 bottom
JP13  22.86,104.14 0 bottom
JP14  1.59,57.47 0 bottom
JP15  48.9,57.47 0 bottom
JP16  25.4,104.14 0 bottom
JP17  48.9,104.14 0 bottom
JP18  46.35,104.14 0 bottom
JP19  38.73,54.93 0 bottom
JP20  9.21,54.93 0 bottom
JP21  6.67,104.14 0 bottom
JP22  43.81,104.14 0 bottom
JP23  41.27,54.93 0 bottom
JP24  41.27,104.14 0 bottom
JP25  30.48,104.14 0 bottom
JP26  9.21,104.14 0 bottom
JP27  20.32,104.14 0 bottom
JP28  27.94,104.14 0 bottom
JP29  11.75,49.85 0 bottom
JP30  11.75,52.39 0 bottom
JP31  4.13,57.47 0 bottom
JP32  9.21,57.47 0 bottom
JP33  46.35,57.47 0 bottom
JP34  41.27,57.47 0 bottom
JP35  38.73,49.85 0 bottom
JP36  38.73,52.39 0 bottom
JP37  11.75,54.93 0 bottom
JP43  30.8,52.39 0 bottom
JP44  41.27,52.39 0 bottom
JP45  9.21,49.85 0 bottom
JP46  4.13,52.39 0 bottom
JP47  46.35,49.85 0 bottom
JP48  4.13,54.93 0 bottom
JP51  4.13,49.85 0 bottom
JP58  46.35,54.93 0 bottom
JP60  46.35,52.39 0 bottom
JP62  9.21,52.39 0 bottom
JP101  30.8,49.85 0 bottom
JP102  38.73,57.47 0 bottom
JP103  19.68,49.85 0 bottom
JP104  11.75,57.47 0 bottom
JP105  19.68,52.39 0 bottom
JP106  19.68,54.93 0 bottom
JP107  19.68,57.47 0 bottom
JP108  30.8,54.93 0 bottom
JP109  30.8,57.47 0 bottom
L5  15.35,95.32 90 top
L6  35.16,95.32 90 top
L7  15.35,61.24 90 top
L8  15.35,55.76 90 top
L9  15.35,50.29 90 top
L10  35.16,55.76 90 top
L11  35.16,50.29 90 top
L12  35.16,61.24 90 top
L13  25.25,72.27 0 top
LED1  15.35,66.76 90 top
LED2  35.16,66.76 90 top
LED3  15.35,44.73 90 top
LED4  35.16,44.73 90 top
LED5  25.25,66.76 90 top
Q2  20,39.37 0 bottom
Q3  29.53,39.37 0 bottom
R1  15.24,91.44 90 bottom
R2  2.22,34.29 180 bottom
R3  2.22,21.59 180 bottom
R4  25.25,95.32 0 top
R5  35.24,91.44 90 bottom
R6  2.22,8.89 180 bottom
R7  23.18,47.94 270 bottom
R9  13.65,65.72 90 bottom
R10  17.14,65.72 270 bottom
R11  36.83,65.72 90 bottom
R12  33.66,65.72 270 bottom
R13  5.44,95.32 0 top
R14  45.06,95.32 0 top
R15  36.83,43.5 90 bottom
R16  25.25,81.04 0 top
R17  33.66,43.5 270 bottom
R18  17.14,43.5 270 bottom
R19  13.65,43.5 90 bottom
R20  5.44,81.04 0 top
R21  45.06,81.04 0 top
R22  20,42.55 180 bottom
R23  29.53,42.54 180 bottom
R24  20,36.2 180 bottom
R25  29.53,36.2 180 bottom
R26  20,34.61 180 bottom
R27  29.53,34.61 0 bottom
R32  19.84,46.99 180 bottom
R33  30.96,22.54 270 bottom
R34  30.96,26.35 270 bottom
R35  32.07,3.49 180 bottom
R36  25.24,62.86 0 bottom
R37  5.44,66.76 0 top
R38  45.06,66.76 0 top
R43  47.15,22.23 270 bottom
R44  32.7,15.88 90 bottom
R45  48.74,22.22 270 bottom
R46  31.11,15.88 90 bottom
R47  42.86,39.05 90 bottom
R48  47.15,39.05 90 bottom
R49  12.7,21.27 180 bottom
R50  8.26,21.27 0 bottom
R51  8.26,16.83 180 bottom
R52  12.7,16.83 0 bottom
R53  48.74,39.05 90 bottom
R54  37.31,39.05 90 bottom
R55  3.17,38.73 90 bottom
R56  7.62,38.73 90 bottom
R60  31.11,9.53 90 bottom
R61  42.23,2.06 0 bottom
R62  29.53,9.53 90 bottom
R63  48.9,9.53 90 bottom
R64  19.05,13.97 270 bottom
R65  11.75,26.35 270 bottom
R66  18.41,3.49 0 bottom
R67  1.59,38.73 90 bottom
R69  19.05,9.84 90 bottom
R73  40.32,21.27 0 bottom
R74  40.32,24.45 180 bottom
R75  17.46,9.84 90 bottom
R76  26.04,52.07 0 bottom
R77  26.04,50.48 0 bottom
R78  40.32,62.55 0 bottom
R79  47.94,62.55 180 bottom
R80  47.94,71.44 180 bottom
R81  40.32,71.44 0 bottom
R82  17.14,61.59 90 bottom
R83  17.14,56.2 90 bottom
R84  17.14,50.8 90 bottom
R85  3.18,26.99 270 bottom
R86  3.17,13.97 270 bottom
R87  8.57,1.91 180 bottom
SW1  15.35,88.18 90 top
SW2  35.16,88.18 90 top
SW3  15.35,73.9 270 top
SW4  35.16,73.9 90 top
SW5  5.44,44.73 0 top
SW6  45.06,44.73 0 top
SW7  25.25,57.46 90 top
U$1  [LOGO_5]  25.08,99.38 0 bottom

### Tracks (layer width: path | path; a pad name or v marks a point on that pad's centre or on a via)
+3V3
  Bottom 0.254: 29.18,48.23 27.81,49.61 26.29,49.61 26.06,49.84 26.06,52.88 22.63,56.31 22.63,58.06 22.86,58.29 24.46,58.29 24.69,58.06 24.69,57.99 25.83,56.84 25.83,56.54 D3.2
  Bottom 0.305: R23.2 31.59,42.55 32.54,43.5 32.54,48.1 JP101.1 29.18,48.23 27.3,46.35 27.3,41.27 26.51,40.48 25.08,40.48 23.02,42.55 R22.2
+3V3_A
  Top 0.305: R4.3 27.75,88.55 27.15,87.95 27.15,74.94 R16.3 | R14.3 47.56,88.65 46.2,90.01 29.14,90.01 R4.3 | R4.3 27.75,88.77 26.51,90.01 9.34,90.01 R13.3 7.94,88.59 7.62,88.27 7.62,74.66 R20.3 7.78,74.18 7.78,65.25 8.89,64.14 8.89,61.01 R37.3 9.15,60.06 JP104.1
  Bottom 0.305: R38.3 48.95,60.06 49.69,60.8 49.69,63.34 47.47,65.56 47.47,68.1 49.69,70.33 49.69,72.21 R21.3 47.56,74.36 47.31,74.61 47.31,88.37 R14.3
ADC_DV_POT
  Bottom 0.152: R4.2 24.98,88.89 C8.1 24.98,102.02 JP13.1
ADC_LENGTH_POT
  Bottom 0.152: R16.2 24.98,74.61 C24.1 25.08,76.62 25.08,81.92 29.37,86.2 29.37,89.69 25.4,93.66 JP16.1
ADC_T_BIAS_POT
  Bottom 0.152: R20.2 4.98,74.81 C28.1 4.98,79.75 11.27,86.04 11.27,92.23 12.38,93.34 12.38,100.01 9.84,102.55 5.71,102.55 JP11.1
ADC_T_JITTER_POT
  Bottom 0.152: JP14.1 1.59,62.87 2.22,63.5 4.6,63.5 5.08,63.02 5.08,62.29 C38.1 5.44,61.92 R37.2
ADC_T_RATE_POT
  Bottom 0.152: R13.2 4.98,89.08 C17.1 4.98,100.75 JP12.1
ADC_X_BIAS_POT
  Bottom 0.152: R21.2 44.66,74.73 C29.1 44.66,84.4 40.96,88.11 40.96,91.6 44.29,94.93 44.29,102.08 JP18.1
ADC_X_SPREAD_POT
  Bottom 0.152: R14.2 44.66,89.01 C18.1 44.61,90.86 44.61,99.85 JP17.1
ADC_X_STEPS_POT
  Bottom 0.152: JP15.1 48.26,57.47 45.88,59.85 45.27,59.85 R38.2 43.69,61.44 41.59,61.44 40.22,60.06 C36.1
DAC_X_1
  Bottom 0.152: JP9.1 47.62,53.66 47.62,51.75 46.99,51.12 45.72,51.12 45.09,50.48 45.09,43.34 42.86,41.12 R47.2
DAC_X_2
  Bottom 0.152: 47.36,39.9 R48.2 47.89,40.64 49.21,40.64 49.53,40.96 49.53,47.94 48.9,48.58 48.26,48.58 47.62,49.21 47.62,51.12 JP7.1
DAC_X_3
  Bottom 0.152: R53.2 48.95,39.9 49.85,40.8 49.85,48.9 JP8.1
DAC_Y
  Bottom 0.152: R54.2 38.63,39.9 39.21,40.48 39.21,43.5 40.48,44.77 40.48,49.05 JP10.1
GATE_T_1  (via drill 0.3)
  Top 0.152: JP3.1 2.86,56.2 2.86,58.1 1.59,59.37 1.59,63.66 3.49,65.56 6.03,65.56 v7.78,63.82
  Bottom 0.152: R56.2 7.62,40.01 5.71,41.91 5.71,52.86 4.92,53.66 2.86,53.66 JP3.1 | v7.78,63.82 11.43,63.82 14.76,60.48 14.83,60.48 L7.A
GATE_T_2  (via drill 0.3)
  Top 0.152: JP5.1 2.86,53.66 5.87,53.66 6.75,54.53 6.75,61.67 v7.78,62.71
  Bottom 0.152: R55.2 3.17,39.53 3.65,40.01 3.65,48.42 2.86,49.21 2.86,51.12 JP5.1 | L8.A 15.35,54.5 14.29,55.56 14.29,60.48 11.27,63.5 8.57,63.5 v7.78,62.71
GATE_T_3  (via drill 0.3)
  Top 0.152: v6.67,53.5 6.67,53.02 4.76,51.12 2.86,51.12 JP6.1
  Bottom 0.152: R67.2 1.53,39.59 0.95,40.16 0.95,49.21 JP6.1 | L9.A 15.35,49.11 13.97,50.48 13.97,60.33 11.11,63.18 9.21,63.18 6.75,60.72 6.75,53.66 v6.67,53.5
GND  (via drill 0.3)
  Top 0.152: R38.1 42.56,58.88 43.5,57.94 43.5,55.88 43.18,55.56 43.18,48.1 44.29,46.99 45.56,46.99 v45.72,46.83 | 7.62,37.95 7.85,37.95 10.74,40.84 10.74,43.66 | 7.62,37.95 5.49,37.95 J10.GND | 10.74,43.66 10.74,44.96 8.76,46.94 SW5.2 | 10.74,43.66 8.23,43.66 8,43.43 6.78,43.43 3.28,46.94 2.21,46.94 SW5.1 | J1.NORM 15.39,22.55 15.39,24.99 J1.GND | J1.GND 15.47,24.99 25.22,24.99 J9.GND 25.3,25.07 35.13,25.07 J2.GND | 7.62,25.07 8.61,25.07 8.84,25.3 15.09,25.3 15.32,25.07 J1.GND | 7.62,25.07 5.49,25.07 J11.GND | 7.62,25.07 7.62,37.95 | SW6.1 41.76,46.94 41.76,44.12 40.62,42.98 40.62,41.6 44.27,37.95 45.03,37.95 J14.GND 45.11,37.87 47.17,35.81 47.17,28.12 45.11,26.06 45.11,25.07 J15.GND 45.11,24.99 47.17,22.94 47.17,18.29 46.48,17.6 46.48,14.63 45.11,13.26 45.11,12.34 J16.GND 45.03,12.27 45.03,11.43 43.13,9.53 43.13,7.32 42.82,7.01 v42.82,4.04 | SW6.2 48.23,46.94 48.23,45.26 45.41,42.44 v45.4,42.39 | J5.GND 15.39,12.27 15.39,9.75 J5.NORM | J5.GND 15.47,12.27 25.22,12.27 J13.GND 25.3,12.27 25.45,12.27 31.59,6.13 | J12.GND 5.49,12.27 15.32,12.27 J5.GND | v37.26,20.5 35.2,22.55 J2.NORM | v40.31,20.27 37.49,20.27 v37.26,20.5 | v31.55,5.33 31.55,6.1 31.59,6.13 | 31.59,6.13 35.13,9.68 J7.NORM | J7.NORM 35.2,9.75 35.2,12.27 J7.GND 35.2,12.34 37.41,14.55 37.41,20.27 v37.26,20.5 | v37.49,5.03 37.49,7.09 35.05,9.53 J7.NORM | v3.05,64.16 2.97,64.08 2.97,60.12 R37.1 | L5.K 15.39,96.55 15.39,95.25 17.6,93.04 SW1.4 | 20.38,74.41 17.68,77.11 SW3.1 | 20.38,74.41 20.42,74.37 22.71,74.37 R16.1 | LED1.2 15.39,66.83 15.39,67.67 17.6,69.88 17.6,70.64 SW3.2 17.68,70.71 20.34,73.38 20.34,74.37 20.38,74.41
  Top 0.152: J6.GND 31.17,44.65 31.17,44.12 35.13,40.16 35.13,37.95 J8.GND 35.2,37.87 35.2,35.36 J8.NORM 35.28,35.36 v37.19,33.45 | LED3.2 15.39,44.65 15.39,43.81 16.15,43.05 16.15,38.71 15.39,37.95 J4.GND | J6.NORM 28.57,44.65 28.57,41.22 25.3,37.95 J3.GND | 35.55,55.36 35.51,55.4 31.32,55.4 30.86,54.94 JP108.1 | 35.55,55.36 36.04,54.86 36.04,46.48 35.2,45.64 35.2,44.73 LED4.2 | v39.05,61.28 39.01,61.27 39.01,59.44 35.59,56.01 35.59,55.4 35.55,55.36 | JP109.1 30.86,57.45 30.86,55.78 31.24,55.4 JP108.1 | L6.K 35.2,96.55 35.2,95.25 37.41,93.04 SW2.4 | R14.1 42.52,88.54 38.94,84.96 37.49,84.96 SW2.3 37.41,84.89 37.41,81.69 32.92,77.19 SW4.2 32.92,77.11 35.66,74.37 42.52,74.37 R21.1 42.6,74.3 43.74,73.15 46.18,73.15 47.02,72.31 47.02,66.6 47.78,65.84 v47.78,64.24 | 32.92,69.88 35.13,67.67 35.13,66.83 LED2.2 | 32.92,69.88 32.92,70.64 SW4.1 32.92,69.88 | 32.92,69.88 28.35,69.88 25.3,66.83 LED5.2 | JP108.1 30.86,55.7 24.46,55.7 23.01,54.25 SW7.1
  Bottom 0.152: J5.GND 16.63,12.29 C53.2 | J5.NORM 16.52,9.75 R75.2 | R49.2 14.09,21.27 J1.NORM | C56.2 14.91,25.5 J1.GND | R37.1 2.94,61.74 C38.2 | C51.2 R73.1 40.32,20.42 40.32,20.27 | R80.2 48.79,72.49 48.26,73.03 43.87,73.03 | 43.87,73.03 R21.1 42.97,74.75 C29.2 | 43.87,73.03 43.28,72.43 C37.1 43.28,72.45 42.7,73.03 40.01,73.03 39.53,72.55 39.53,71.49 R81.2 | C39.2 43.28,62.33 42.7,61.75 40.27,61.75 | 40.27,61.75 R78.2 39.47,61.7 v39.05,61.28 | R25.1 28.68,38.17 Q3.2 28.73,38.1 29.53,38.9 | C49.1 40.32,20.27 | R24.1 19.15,38.17 Q2.2 | SW4.1 SW4.2 | C18.2 42.97,89.02 R14.1 | R4.1 23.28,89.15 C8.2 23.24,90.83 18.21,90.83 17.68,91.36 SW1.4 18.14,90.83 18.14,85.42 17.68,84.96 SW1.3 SW3.1 | C17.2 3.28,88.95 R13.1 2.97,88.54 2.97,76.89 3.28,76.58 C28.2 3.28,74.67 R20.1 3.05,74.37 3.05,65.3 | C24.2 23.28,74.87 R16.1 | SW2.3 SW2.4 | v45.72,46.83 45.72,42.7 v45.4,42.39 45.34,42.37 45.11,42.14 45.11,37.95 J14.GND | C36.2 38.73,60.01 40.01,61.28 40.01,61.49 40.27,61.75 | R50.2 7.39,21.34 7.39,22.33 5.49,24.23 5.49,24.99 J11.GND | IC9.11 10.44,15.09 10.44,14.71 10.06,14.33 7.7,14.33 5.94,16.08 3.05,16.08 2.36,15.39 2.36,12.5 2.52,12.34 5.41,12.34 J12.GND 5.49,12.27 7.62,12.27 9.75,10.13 9.75,9.68 IC9.5 9.75,9.6 9.75,9.22 8.76,8.23 8.76,5.56 8.53,5.33 8.53,4.34 8.91,3.96 9.53,3.96 10.44,4.88 10.44,6.1 C50.2 | C58.2 19.28,2.06 21.95,4.72 21.95,8.99 25.22,12.27 J13.GND | 35.17,29.45 36.12,30.4 36.2,30.4 37.41,31.62 37.41,31.93 J8.C 37.41,32 37.41,33.22 v37.19,33.45 | 35.17,29.45 32.92,27.2 32.61,27.2 C57.2 | 34.4,23.28 35.13,22.55 J2.NORM | 34.4,23.28 34.37,23.32 32.61,23.32 C45.2 | v37.26,20.5 37.41,20.34 37.41,19.2 J2.C
  Bottom 0.152: v40.31,20.27 40.32,20.27 | 34.4,23.28 35.13,24 35.13,24.99 J2.GND 35.2,25.07 36.35,26.21 36.35,28.27 35.17,29.45 | 39.66,3.47 39.62,3.43 39.17,3.43 37.53,5.07 | 39.66,3.47 40.31,4.12 40.31,6.1 C48.2 | 37.53,5.07 37.49,5.11 37.49,6.4 J7.C | 42.86,3.24 42.14,2.52 42.14,1.45 41.91,1.22 40.84,1.22 39.7,2.36 39.7,3.43 39.66,3.47 | 42.86,3.24 42.98,3.35 44.65,3.35 47.32,6.02 J16.C | C54.2 32.92,12.65 34.82,12.65 35.13,12.34 J7.GND | v31.55,5.33 30.48,4.27 30.48,2.82 31.17,2.13 31.17,1.91 C55.2 | v37.49,5.03 37.53,5.07 | v42.82,4.04 42.82,3.28 42.86,3.24 | 3.05,65.3 v3.05,64.16 | 3.05,65.3 8.69,65.3 9.07,64.92 12.27,64.92 13.18,65.84 14.4,65.84 14.44,65.88 | 14.44,65.88 15.32,66.75 LED1.2 | 29.53,38.9 30.71,40.08 32.38,40.08 D5.+ | 29.53,38.9 27.89,40.54 27.89,43.97 28.57,44.65 J6.NORM 28.65,44.73 31.09,44.73 J6.GND | 22.86,40.08 23.09,40.08 25.22,37.95 J3.GND | Q2.2 19.13,37.87 15.39,37.87 J4.GND 15.39,37.8 15.39,35.36 J4.NORM | 22.86,40.08 21.18,40.08 19.2,38.1 Q2.2 | 22.86,40.08 D4.+ | v47.78,64.24 48.77,63.25 48.77,62.56 R79.2 | JP105.1 19.58,52.43 17.14,49.99 R84.1 17.14,48.08 17.98,47.24 17.98,43.74 17.83,43.59 16.46,43.59 15.39,44.65 LED3.2 | 18.21,55.32 19.28,55.32 19.58,55.02 JP106.1 19.81,54.18 22.94,54.18 SW7.1 | 18.21,55.32 17.14,55.32 R83.1 | 18.21,60.73 22.94,60.73 SW7.2 | 18.21,60.73 R82.1 17.14,60.81 15.85,60.81 14.48,62.18 14.48,65.84 14.44,65.88 | D3.1 25.83,58.45 25.22,58.45 23.01,60.66 SW7.2 | LED5.2 25.22,66.75 25.22,65.91 22.94,63.63 22.94,60.81 SW7.2 | 18.21,60.73 18.21,55.32
  Bottom 0.305: JP105.1 JP106.1
  other vias: 31.27,19.21 27.15,16.35 23.5,16.35 27.62,13.18 30.64,6.99 49.05,1.43 46.99,28.1 17.62,17.14 2.7,17.78 11.59,22.54 7.3,35.24 5.56,56.2 6.19,63.66 33.18,61.59 48.74,77.47 48.74,76.36 40.01,77.95 15.4,74.14 19.21,7.46 26.83,3.02 22.86,35.08 41.75,36.83 38.73,38.89 36.35,52.07 26.99,47.62 29.53,66.2
  pour Top: 0,0 50.48,0 50.48,108.11 0,108.11
  pour Bottom: 0,0 50.48,0 50.48,108.11 0,108.11
L_DV_CV  (via drill 0.3)
  Top 0.152: v13.81,47.78 17.14,47.78 v17.78,48.42
  Bottom 0.152: JP62.1 10.48,51.12 12.7,51.12 13.34,50.48 13.34,48.26 v13.81,47.78 | R32.1 18.99,47.2 v17.78,48.42
L_T_BIAS_CV  (via drill 0.3)
  Top 0.152: v6.67,45.88 5.71,45.88 4.76,46.83 v4.76,47.47
  Bottom 0.152: R64.1 19.05,26.35 15.88,29.53 11.75,29.53 10.64,30.64 10.64,39.05 8.89,40.8 7.78,40.8 6.35,42.23 6.35,45.56 v6.67,45.88 | v4.76,47.47 5.4,48.1 5.4,51.12 JP46.1
L_T_JITTER_CV  (via drill 0.3)
  Top 0.152: v6.99,44.13 4.13,46.99 JP51.1
  Bottom 0.152: R66.1 19.27,3.71 20.16,4.6 20.16,15.56 19.37,16.35 19.37,26.51 16.03,29.84 11.91,29.84 10.95,30.8 10.95,39.21 9.05,41.12 7.94,41.12 6.67,42.39 6.67,43.81 v6.99,44.13
L_T_RATE_CV
  Bottom 0.152: R65.1 11.69,27.2 10.32,28.57 10.32,38.89 8.73,40.48 7.62,40.48 6.03,42.07 6.03,53.02 JP48.1
L_X_BIAS_CV  (via drill 0.3)
  Top 0.152: JP60.1 v44.45,52.39
  Bottom 0.152: R33.1 31.22,23.39 30.16,24.45 30.16,31.43 31.43,32.7 31.43,33.18 32.23,33.97 32.86,33.97 33.97,35.08 33.97,36.35 34.29,36.67 36.35,36.67 36.67,36.35 39.05,36.35 39.85,37.15 39.85,43.18 41.43,44.77 43.5,44.77 44.45,45.72 44.45,50.8 44.77,51.12 44.77,52.07 v44.45,52.39
L_X_SPREAD_CV
  Bottom 0.152: R34.1 31.38,27.2 30.48,28.1 30.48,31.27 31.75,32.54 31.75,33.02 32.38,33.66 33.02,33.66 33.5,34.13 38.89,34.13 40.16,35.4 40.16,43.02 41.59,44.45 43.66,44.45 44.77,45.56 44.77,50.64 45.09,50.96 45.09,53.66 JP58.1
L_X_STEPS_CV  (via drill 0.3)
  Top 0.152: v49.53,14.13 49.85,14.45 49.85,38.73 v47.15,41.43
  Bottom 0.152: JP47.1 46.35,48.74 46.99,48.1 46.99,41.43 v47.15,41.43 | R35.1 31.22,3.75 31.91,4.45 37.15,4.45 40.8,0.79 47.31,0.79 49.85,3.33 49.85,13.81 v49.53,14.13
LED_T_DV
  Bottom 0.152: R1.1 15.24,90.65 16.35,91.76 16.35,100.17 JP27.1
LED_T_MODE_G  (via drill 0.3)
  Top 0.152: JP32.1 10.48,56.2 12.38,56.2 13.02,56.83 13.02,64.93 13.81,65.72 16.03,65.72 17.14,66.83 v17.14,68.1
  Bottom 0.152: R10.1 v17.14,68.1
LED_T_MODE_R  (via drill 0.3)
  Top 0.152: JP31.1 4.21,57.55 4.21,64.53 v4.29,64.61
  Bottom 0.152: v4.29,64.61 13.39,64.61 R9.1
LED_T_RANGE_G
  Bottom 0.152: JP30.1 13.18,52.39 13.65,51.91 13.65,49.21 14.76,48.1 16.35,48.1 17.14,47.31 R18.1
LED_T_RANGE_R
  Bottom 0.152: R19.1 13.23,42.65 11.75,44.13 JP29.1
LED_X_DV
  Bottom 0.152: R5.1 35.24,90.65 34.13,91.76 34.13,100.49 JP25.1
LED_X_EXT_G  (via drill 0.3)
  Top 0.152: v26.83,90.96 26.83,103.03 JP28.1
  Bottom 0.152: R36.1 26.09,69.64 25.08,70.64 23.81,70.64 20.95,73.5 20.95,76.68 24.77,80.49 24.77,82.07 29.05,86.36 29.05,89.53 27.62,90.96 v26.83,90.96
LED_X_MODE_G
  Bottom 0.152: R12.1 33.55,66.57 32.7,65.72 32.7,63.66 37.47,58.9 39.85,58.9 JP34.1
LED_X_MODE_R
  Bottom 0.152: JP33.1 43.18,57.47 41.43,59.21 37.62,59.21 36.04,60.8 36.04,63.98 36.35,64.29 36.35,64.4 R11.1
LED_X_RANGE_G
  Bottom 0.152: JP36.1 37.47,51.12 37.47,49.53 35.72,47.78 34.45,47.78 33.66,46.99 R17.1
LED_X_RANGE_R
  Bottom 0.152: R15.1 37.41,42.65 38.73,43.97 JP35.1
MORPH_IN
  Bottom 0.152: J1.IN 17.38,14.91 C53.1 17.46,14.71 R64.2
MORPH_IN1
  Bottom 0.152: J7.IN 34.93,1.91 C55.1 R35.2
MORPH_IN3
  Bottom 0.152: R65.2 11.75,25.61 C56.1 14.84,27.2 J4.IN
MORPH_IN4
  Bottom 0.152: R34.2 C57.1 33.02,25.58 J8.IN
MORPH_IN5  (via drill 0.3)
  Top 0.152: v30.48,32.7 28.89,32.7 v28.1,33.5 | v21.59,41.27 20.95,41.88 J6.IN
  Bottom 0.152: C54.1 30.48,12.7 29.84,13.34 29.84,32.07 v30.48,32.7 | J6.IN 20.97,46.71 R32.2 | v28.1,33.5 27.78,33.81 27.78,38.1 25.88,40.01 24.92,40.01 23.34,41.59 21.91,41.59 v21.59,41.27
MORPH_IN6
  Bottom 0.152: J5.IN 17.34,2.13 C58.1 R66.2
MORPH_IN7
  Bottom 0.152: C45.1 R33.2 30.16,20.9 30.16,14.45 30.32,14.29 34.29,14.29 34.91,14.91 J2.IN
N$1
  Bottom 0.152: R1.2 15.24,93.94 L5.A
N$2
  Bottom 0.152: R5.2 35.24,93.96 L6.A
N$3  (via drill 0.3)
  Top 0.152: v10.64,23.5 v9.05,23.5
  Bottom 0.152: IC9.12 11.13,16.02 10.32,16.83 10.32,23.18 v10.64,23.5 | v9.05,23.5 9.68,24.13 9.68,35.4 8.41,36.67 4.39,36.67 R55.1
N$4  (via drill 0.3)
  Top 0.152: v8.31,30.63 8.31,36.35 v11.51,39.55
  Bottom 0.152: v8.31,30.63 7.77,31.17 7.77,31.93 J10.C | v11.51,39.55 11.51,33.53 13.03,32 J4.A
N$5  (via drill 0.3)
  Top 0.152: v20.42,31.93 20.8,31.93 v22.1,30.63
  Bottom 0.152: v20.42,31.93 17.68,31.93 J4.C | v22.1,30.63 22.1,31.09 22.94,31.93 J3.A
N$6  (via drill 0.3)
  Top 0.152: v11.59,19.21 11.59,21.27 10.16,22.7 v7.94,22.7
  Bottom 0.152: J11.C 7.71,19.61 8.26,20.16 8.26,22.38 v7.94,22.7 | J1.A 11.61,19.19 v11.59,19.21
N$7  (via drill 0.3)
  Top 0.152: v21.64,20.5 v18.36,20.5
  Bottom 0.152: v18.36,20.5 17.68,19.81 17.68,19.2 J1.C | v21.64,20.5 22.94,19.2 J9.A
N$8  (via drill 0.3)
  Top 0.152: v31.55,30.63 v28.19,30.63
  Bottom 0.152: v28.19,30.63 27.58,31.24 27.58,31.93 J3.C | v31.55,30.63 32.84,31.93 J8.A
N$9
  Bottom 0.152: R19.2 13.65,45.03 LED3.3
N$10
  Bottom 0.152: J12.C 7.77,6.4 7.77,3.28 8.69,2.36 8.69,1.22 8.84,1.07 10.13,1.07 13.03,3.96 13.03,6.4 J5.A
N$11  (via drill 0.3)
  Top 0.152: v48.31,30.18 48.31,18.67 48.92,18.06 48.92,14.48 48.84,14.4 48.84,6.71 45.49,3.35 v27.96,3.35 | v20.42,30.94 19.74,31.62 19.74,34.37 26.59,41.22 v26.59,41.6
  Bottom 0.152: v48.31,30.18 48.31,32.84 47.32,33.83 44.27,33.83 42.82,32.38 42.82,32 J14.A | v27.96,3.35 27.96,5.03 28.5,5.56 28.5,9.14 26.44,11.2 26.44,12.8 25.53,13.72 24.77,13.72 20.42,18.06 v20.42,30.94 | v26.59,41.6 26.14,41.6 25.3,42.44 J6.C
N$12
  Bottom 0.152: LED3.1 17.07,42.73 R18.2
N$13  (via drill 0.3)
  Top 0.152: v31.55,17.83 v28.19,17.83
  Bottom 0.152: v28.19,17.83 27.58,18.44 27.58,19.13 J9.C | v31.55,17.83 32.84,19.13 J2.A
N$14
  Bottom 0.152: IC9.8 8.39,15.1 7.3,16.19 7.3,16.73 R51.1 2.22,16.83 1.83,17.22 1.83,20.4 2.22,20.8 2.22,25.08 3.17,26.04 R85.2
N$15
  Bottom 0.152: J5.C 17.68,6.4 17.68,4.8 18.52,3.96 18.52,1.22 18.67,1.07 19.81,1.07 22.94,4.19 22.94,6.4 J13.A
N$16
  Bottom 0.152: R9.2 13.65,67.07 LED1.3
N$17
  Bottom 0.152: J13.C 27.51,6.4 27.51,6.02 24.84,3.35 24.77,3.35 24.08,2.67 24.08,1.6 24.77,0.91 26.98,0.91 30.18,4.12 30.18,4.88 31.7,6.4 32.84,6.4 J7.A
N$18
  Bottom 0.152: R11.2 36.83,67.09 LED2.3
N$19  (via drill 0.3)
  Top 0.152: v43.43,21.03 43.43,30.1 v43.36,30.18
  Bottom 0.152: v43.43,21.03 42.82,20.42 42.82,19.2 J15.A | v43.36,30.18 44.65,30.18 44.73,30.1 45.8,30.1 47.32,31.62 47.32,31.93 J14.C
N$20
  Bottom 0.152: R12.2 35.05,64.87 LED2.1
N$21
  Bottom 0.152: LED4.3 35.66,46.73 36.83,45.56 R15.2
N$22
  Bottom 0.152: LED1.1 17.04,64.76 R10.2
N$23
  Bottom 0.152: R17.2 35.08,42.65 LED4.1
N$24
  Bottom 0.152: R85.1 5.32,27.84 J10.IN
N$25  (via drill 0.3)
  Top 0.152: v43.81,4.27 45.95,4.27 48.54,6.86 48.54,16 48.62,16.08 48.62,17.45 v48.23,17.83
  Bottom 0.152: v43.81,4.27 42.82,5.26 42.82,6.4 J16.A | v48.23,17.83 48.23,18.29 47.4,19.13 J15.C
N$26
  Bottom 0.152: IC9.9 9.18,16.75 R51.2 9.11,16.88 9.68,17.46 9.68,20.69 R50.1
N$27
  Bottom 0.152: R2.2 3.12,34.29 3.12,32 J10.A
N$28
  Bottom 0.152: R82.2 15.41,62.45 L7.K
N$29
  Bottom 0.152: IC9.10 9.83,16.02 10,16.19 10,35.56 8.1,37.47 8.04,37.47 R56.1
N$30
  Bottom 0.305: IC9.7 IC9.6
N$31
  Bottom 0.152: J12.A 3.18,8.79 R6.2
N$32
  Bottom 0.152: R7.2 25.15,47.09 J6.A
N$33
  Bottom 0.152: J11.A 3.18,21.49 R3.2
N$34
  Bottom 0.152: R52.1 13.65,16.73 13.65,16.19 12.56,15.1 IC9.14 12.38,15.05 12.38,14.29 11.75,13.65 4.45,13.65 3.91,13.12 R86.2
N$35
  Bottom 0.152: IC9.13 11.78,16.75 R52.2 11.27,16.83 10.64,17.46 10.64,20.64 11.27,21.27 R49.1
N$36
  Bottom 0.152: J9.IN 28.08,14.91 28.89,15.72 28.89,33.02 30.16,34.29 30.54,34.29 R27.1
N$37  (via drill 0.3)
  Top 0.152: v10.64,24.61 v9.05,24.61
  Bottom 0.152: IC9.3 11.13,12.56 14.45,15.88 14.45,17.46 13.97,17.94 11.27,17.94 10.95,18.26 10.95,20 11.27,20.32 12.54,20.32 12.7,20.48 12.7,22.54 v10.64,24.61 | v9.05,24.61 9.37,24.92 9.37,33.18 8.57,33.97 4.92,33.97 1.59,37.31 R67.1
N$38
  Bottom 0.152: R87.2 10.48,1.91 11.75,3.17 11.75,8.26 12.38,8.89 | 12.38,8.89 12.38,9.62 IC9.1 | R69.1 19.05,8.89 18.26,8.1 16.67,8.1 16.35,8.41 14.29,8.41 13.97,8.1 13.18,8.1 12.38,8.89
N$39
  Bottom 0.152: R86.1 5.35,14.82 J11.IN
N$40
  Bottom 0.152: J12.IN 7.72,2.13 R87.1
N$41
  Bottom 0.152: R75.1 17.46,9.21 17.57,9.21 R69.2 18,11.75 16.83,11.75 16.03,10.95 12.06,10.95 11.78,10.67 IC9.2
N$42
  Bottom 0.152: R36.2 24.39,63.9 LED5.1
N$43  (via drill 0.3)
  Top 0.305: v23.93,50.6 23.93,51.51 20.95,54.48 20.95,56.24 19.74,57.45 JP107.1 | v24.31,48.84 23.32,48.84 16.84,42.37 v16.84,40.92 | v10.06,41.07 6.86,41.07 v1.45,35.66
  Bottom 0.305: R6.1 R3.1 R2.1 1.45,34.37 v1.45,35.66 | v23.93,50.6 23.24,49.91 23.24,48.84 R7.1 23.39,48.84 v24.31,48.84 | v16.84,40.92 10.21,40.92 v10.06,41.07
N$44
  Bottom 0.152: R83.2 15.36,57.05 L8.K
N$45  (via drill 0.3)
  Top 0.152: v42.55,56.2 42.55,58.1 41.12,59.53 41.12,63.98 41.43,64.29 42.7,64.29 v43.81,65.41
  Bottom 0.152: R62.2 29.53,10.79 30,11.27 | 33.08,10.38 C43.2 32.38,10.69 32.38,10.79 | 38.42,10.16 38.42,9.71 IC7.7 38.37,10.12 38.42,10.16 | 38.42,10.16 38.1,10.16 37.31,10.95 33.66,10.95 33.08,10.38 | 33.08,10.38 33.02,10.32 32.86,10.32 32.38,10.79 | 32.38,10.79 31.91,11.27 30,11.27 | 30,11.27 29.53,11.75 29.53,32.7 30.32,33.5 31.27,33.5 32.07,34.29 32.7,34.29 33.66,35.24 33.66,38.26 34.77,39.37 35.56,39.37 36.51,38.42 36.51,36.99 36.83,36.67 38.89,36.67 39.53,37.31 39.53,43.34 41.27,45.09 42.55,45.09 43.18,45.72 43.18,55.56 v42.55,56.2 | IC10.5 44.44,64.75 v43.81,65.41
N$46  (via drill 0.3)
  Top 0.152: v27.46,48.9 29.84,46.51 29.84,41.27 26.99,38.42 26.99,36.99 v26.67,36.67
  Bottom 0.152: R77.2 25.18,50.06 26.35,48.9 v27.46,48.9 | v26.67,36.67 26.67,34.77 25.88,33.97 22.7,33.97 21.43,32.7 21.43,26.35 J9.NORM
N$47  (via drill 0.3)
  Top 0.152: v22.23,43.5 23.81,41.91 23.81,39.37 v22.86,38.42
  Bottom 0.152: R76.2 24.45,52.07 22.07,49.69 22.07,46.2 22.38,45.88 22.38,43.66 v22.23,43.5 | v22.86,38.42 23.97,37.31 23.97,36.61 J3.NORM
N$48
  Bottom 0.152: R84.2 15.44,51.65 L9.K
N$49  (via drill 0.3)
  Top 0.152: v40.16,13.34 v41.75,13.34
  Bottom 0.152: R46.1 R44.1 32.96,15.03 34.45,16.51 35.4,16.51 38.58,13.34 v40.16,13.34 | v41.75,13.34 42.7,13.34 44.29,14.92 45.04,14.92 J15.IN
N$50
  Bottom 0.152: R24.2 R26.2 | R24.2 20.85,38.17 Q2.1 | R24.2 22.34,36.2 D4.-
N$52
  Bottom 0.152: R27.2 28.79,34.61 R25.2 | R25.2 32.18,36.2 D5.- | R25.2 30.38,38.17 Q3.1
N$53
  Bottom 0.152: J13.IN 27.69,2.13 29.53,3.97 R62.1 R60.1
N$54  (via drill 0.3)
  Top 0.152: v40.8,29.53 v42.39,29.53
  Bottom 0.152: IC7.9 39.02,16.12 C35.1 | C35.1 38.47,16.93 37.78,17.62 36.2,17.62 35.72,17.14 33.12,17.14 R44.2 | C35.1 38.31,17.2 38.73,17.62 38.73,27.94 40.32,29.53 v40.8,29.53 | v42.39,29.53 48.58,29.53 49.21,30.16 49.21,36.14 R48.1
N$57
  Bottom 0.152: J3.IN 25.25,27.61 26.83,26.04 26.83,22.07 25.88,21.11 24.77,21.11 21.11,24.77 21.11,32.65 R26.1
N$58
  Bottom 0.152: R61.1 44.84,2.06 J16.IN 47.53,2.13 48.9,3.49 R63.1
N$59
  Bottom 0.152: C44.1 47.25,8.68 46.83,8.26 42.39,8.26 41.59,9.05 | 41.59,9.05 41.59,9.63 IC7.2 41.62,11.78 43.5,13.65 46.99,13.65 49.53,16.19 49.53,37.41 R53.1 | R61.2 41.38,8.83 41.59,9.05
N$60  (via drill 0.3)
  Top 0.152: v47.94,16.35 47.94,15.72 v47.15,14.92
  Bottom 0.152: C34.1 41.62,16.12 IC7.13 41.59,15.07 41.59,14.45 41.75,14.29 42.7,14.29 44.45,16.03 44.61,16.03 44.77,16.19 45.88,16.19 v47.15,14.92 | C34.1 42.33,16.93 | v47.94,16.35 48.9,17.3 48.9,20.32 48.58,20.64 47.62,20.64 47.31,20.95 R43.2 46.93,21.38 46.67,21.11 44.29,21.11 43.34,22.07 43.34,26.51 41.43,28.42 41.43,35.08 42.86,36.51 R47.1 | C34.1 42.33,16.77 42.23,16.67
N$61
  Bottom 0.152: 33.34,8.26 32.92,8.68 C43.1 32.23,9.15 32.23,9.21 | 39.02,9.02 39.05,9.05 39.05,9.63 IC7.6 39.02,9.02 | 33.34,8.26 33.18,8.26 32.23,9.21 | R60.2 31.22,10.38 31.27,10.32 31.27,10.16 31.43,10 | 31.43,10 32.23,9.21 | 39.02,9.02 38.26,8.26 33.34,8.26 | 31.43,10 30.8,10 30.32,9.53 28.57,9.53 28.26,9.84 28.26,11.43 29.21,12.38 29.21,32.86 30.16,33.81 31.11,33.81 31.91,34.61 32.54,34.61 33.34,35.4 33.34,38.42 34.61,39.69 35.82,39.69 R54.1
N$63
  Bottom 0.152: R45.1 47.31,23.07 R43.1 47.15,25.72 45.72,27.15 45.63,27.15 J14.IN
N$67  (via drill 0.3)
  Top 0.152: v36.99,63.34 36.99,68.74 33.66,72.07 31.75,72.07 v31.27,71.6
  Bottom 0.152: R78.1 41.17,62.6 | 41.17,62.6 41.27,62.71 42.07,62.71 42.7,63.34 43.5,63.34 43.81,63.66 43.81,64.25 IC10.6 | 41.17,62.6 41.17,62.65 40.01,63.82 37.47,63.82 v36.99,63.34 | v31.27,71.6 27.19,71.6 L13.K
N$68  (via drill 0.3)
  Top 0.152: v37.47,61.12 37.47,60.64 35.72,58.9 34.61,58.9 33.97,59.53 33.97,66.83 v31.59,69.22
  Bottom 0.152: IC10.7 43.18,64.29 42.86,64.29 42.7,64.14 36.67,64.14 36.35,63.82 36.35,62.23 v37.47,61.12 | v31.59,69.22 29.69,71.12 25.13,71.12 L13.A
N$70  (via drill 0.3)
  Top 0.152: v43.81,40.96 v43.81,46.04 | v43.81,55.09 43.81,64.14 v45.09,65.41
  Bottom 0.152: IC7.14 42.3,15.1 C34.2 45.72,16.83 46.83,15.72 48.58,15.72 49.21,16.35 49.21,20.9 R45.2 48.9,21.43 48.1,22.23 46.51,22.23 46.35,22.38 46.35,26.04 46.04,26.35 43.97,26.35 41.75,28.57 41.75,34.92 43.81,36.99 v43.81,40.96 | v43.81,46.04 43.5,46.35 43.5,54.77 v43.81,55.09 | IC10.3 45.73,64.75 v45.09,65.41
N$71
  Bottom 0.152: R79.1 46.38,63.26 IC10.2 46.38,66.33 46.04,66.67 43.81,66.67 41.59,64.45 38.89,64.45 37.62,65.72 36.2,65.72 36.04,65.56 36.04,64.45 35.24,63.66 35.24,62.6 L12.K
N$72  (via drill 0.3)
  Top 0.152: v38.1,67.63 37.78,67.31 37.78,62.6 L12.A
  Bottom 0.152: IC10.1 47.03,66.15 46.2,66.99 43.66,66.99 41.43,64.77 39.05,64.77 37.78,66.04 37.78,67.31 v38.1,67.63
N$73  (via drill 0.3)
  Top 0.152: v44.45,44.29 46.2,44.29 46.99,45.09 46.99,48.1 46.51,48.58 44.29,48.58 43.81,49.05 43.81,53.66 44.77,54.61 44.77,55.24 45.72,56.2 46.99,56.2 47.62,56.83 47.62,58.1 49.05,59.53 49.05,60.8 46.67,63.18 46.67,67.63 v45.72,68.58
  Bottom 0.152: IC7.8 38.37,15.35 38.26,15.4 38.2,15.4 C35.2 34.29,16.83 33.34,15.88 31.59,15.88 31.12,16.34 | 31.12,16.34 31.11,16.35 | v44.45,44.29 44.29,44.13 41.75,44.13 40.48,42.86 40.48,30.16 36.67,26.35 36.67,22.07 35.88,21.27 33.81,21.27 33.18,20.64 31.11,20.64 30.48,20 30.48,17.62 31.11,16.99 R46.2 31.17,16.69 31.17,16.38 31.12,16.34 | IC10.12 45.73,68.59 v45.72,68.58
N$74
  Bottom 0.152: R80.1 46.38,70.73 IC10.13 46.38,68.29 45.88,67.79 43.18,67.79 41.75,69.22 38.89,69.22 38.42,68.74 36.51,68.74 35.56,69.69 34.61,69.69 32.38,67.47 32.38,59.85 34.77,57.47 34.77,57.42 L10.K
N$75  (via drill 0.3)
  Top 0.152: v38.42,66.67 38.26,66.52 38.26,60.33 v36.51,58.58
  Bottom 0.152: IC10.14 47.03,68.47 46.04,67.47 43.02,67.47 41.59,68.9 39.05,68.9 38.73,68.58 38.73,66.99 v38.42,66.67 | v36.51,58.58 36.51,55.85 L10.A
N$76  (via drill 0.3)
  Top 0.152: v46.35,47.78 43.97,47.78 43.5,48.26 43.5,53.82 44.45,54.77 44.45,57.47 46.35,59.37 46.35,60.64 46.99,61.28 46.99,62.39 46.35,63.02 46.35,66.67 v44.45,68.58
  Bottom 0.152: R63.2 C44.2 47.09,10.38 | 47.09,10.38 46.51,10.95 43.56,10.95 IC7.1 | 47.09,10.38 47.15,10.32 47.15,13.34 49.85,16.03 49.85,38.73 49.53,39.05 46.51,39.05 46.35,39.21 v46.35,47.78 | IC10.10 44.44,68.59 v44.45,68.58
N$77
  Bottom 0.152: 42.23,70.48 42.12,70.48 R81.1 | IC10.9 43.78,70.2 43.5,70.48 42.23,70.48 | 42.23,70.48 41.59,69.85 38.58,69.85 38.1,69.37 36.83,69.37 35.88,70.33 34.29,70.33 31.75,67.79 31.75,59.53 33.97,57.31 33.97,48.9 34.77,48.1 35.56,48.1 36.04,48.58 36.04,50.68 L11.K
N$78
  Bottom 0.152: IC10.8 43.13,69.89 42.86,70.17 42.39,70.17 41.75,69.53 38.73,69.53 38.26,69.06 36.67,69.06 35.72,70.01 34.45,70.01 32.07,67.63 32.07,59.69 34.29,57.47 34.29,49.88 L11.A
NORMALIZATION_PROBE
  Bottom 0.152: D3.3 23.66,56.03 26.83,52.86 26.83,52.13 R76.1 | R76.1 R77.1 | R76.1 30.48,52.07 JP43.1
SW_T_DV
  Bottom 0.152: SW1.1 SW1.2 13.09,100.26 JP26.1
SW_T_MODE
  Bottom 0.152: SW3.4 SW3.3 13.09,82.8 11.59,84.3 11.59,92.08 12.7,93.19 12.7,100.17 10,102.87 7.94,102.87 JP21.1
SW_T_RANGE
  Top 0.152: SW5.3 SW5.4
  Bottom 0.152: SW5.4 8.65,42.47 7.78,43.34 7.78,45.72 6.35,47.15 6.35,52.07 JP20.1
SW_X_DV
  Bottom 0.152: SW2.2 SW2.1 35.27,82.55 37.31,82.55 40.32,85.57 40.32,91.92 43.66,95.25 43.66,101.76 JP24.1
SW_X_EXT  (via drill 0.3)
  Top 0.152: SW7.3 29.61,54.21 30.16,53.66 34.61,53.66 v35.24,53.02
  Bottom 0.152: JP19.1 38.73,54.29 37.47,53.02 v35.24,53.02 | SW7.4 SW7.3
SW_X_MODE
  Bottom 0.152: SW4.3 SW4.4 37.47,77.2 37.47,82.23 40.64,85.41 40.64,91.76 43.97,95.09 43.97,103.98 JP22.1
SW_X_RANGE
  Top 0.152: SW6.3 41.83,42.47 41.91,42.55 | 41.91,42.55 43.18,43.81 43.18,47.62 42.86,47.94 42.86,53.34 JP23.1 | 41.91,42.55 41.91,40.8 42.7,40.01 44.45,40.01 46.99,42.55 48.23,42.55 SW6.4
T_CLOCK
  Bottom 0.152: Q2.3 20,41.7 R22.1 19.15,42.49 18.26,41.59 13.02,41.59 11.27,43.34 11.27,47.78 JP45.1
VCC  (via drill 0.3)
  Top 0.305: v46.2,61.44 45.88,61.75 45.88,66.52 45.4,66.99 44.13,66.99 41.91,64.77 41.27,64.77 40.64,64.14 40.64,59.37 JP102.1 38.73,57.31 37.47,56.04 37.47,49.21 40.01,46.67 40.01,28.89 42.7,26.19 42.7,7.46 v39.37,4.13 9.68,4.13 v9.21,4.6
  Bottom 0.305: IC9.4 C50.1 9.21,6.57 v9.21,4.6 | IC7.4 C48.1 39.37,6.88 v39.37,4.13 | IC10.4 45.09,62.65 C39.1 44.98,62.33 45.88,61.44 v46.2,61.44
VEE  (via drill 0.3)
  Top 0.305: v46.04,72.39 45.88,72.55 28.89,72.55 26.99,70.64 21.27,70.64 18.26,67.63 18.26,51.28 JP103.1 28.89,49.85 33.66,45.09 33.66,42.23 39.37,36.51 39.37,28.73 41.75,26.35 41.75,18.1 v41.43,17.78
  Bottom 0.305: IC7.11 C49.2 40.58,16.93 v41.43,17.78 | IC10.11 45.09,71.33 C37.2 45.09,71.44 v46.04,72.39 | JP103.1 19.68,50.48
VREF  (via drill 0.3)
  Top 0.305: JP37.1 13.34,53.34 13.34,48.9 12.22,47.78 12.22,31.27 13.97,29.53 37.78,29.53 40.96,26.35 v40.96,25.88
  Bottom 0.305: v40.96,25.88 40.96,24.66 R74.2
VREF_BIAS
  Bottom 0.152: R74.1 C51.1 R73.2 39.47,16.09 39.69,15.88 39.69,15.12 IC7.10 39.67,14.46 40.01,14.13 40.64,14.13 40.96,14.45 40.96,15.09 IC7.12 IC7.3 40.96,9.68 40.96,10.32 40.64,10.64 40.01,10.64 39.67,10.3 IC7.5
X_CLOCK
  Bottom 0.152: R23.1 29.53,41.7 Q3.3 30.33,41.27 38.26,41.27 38.89,41.91 38.89,43.66 40.01,44.77 40.01,51.12 JP44.1

### Text on the board
bPlace: BASED ON THE / MUTABLE INSTRUMENTS / MARBLES, DESIGNED BY / OLIVIER GILLET / / REDESIGN BY / DAVID SZEBENYI | ANTUMBRA | CARA | V1.2
bNames: cc-by-sa Olivier Gillet
tStop: Marbles | cc-by-sa Olivier Gillet | 2017. v7